# EAGLE schematic RASPILOT_BETA (EAGLE 7.2.0)

## Sheet 1 of 9
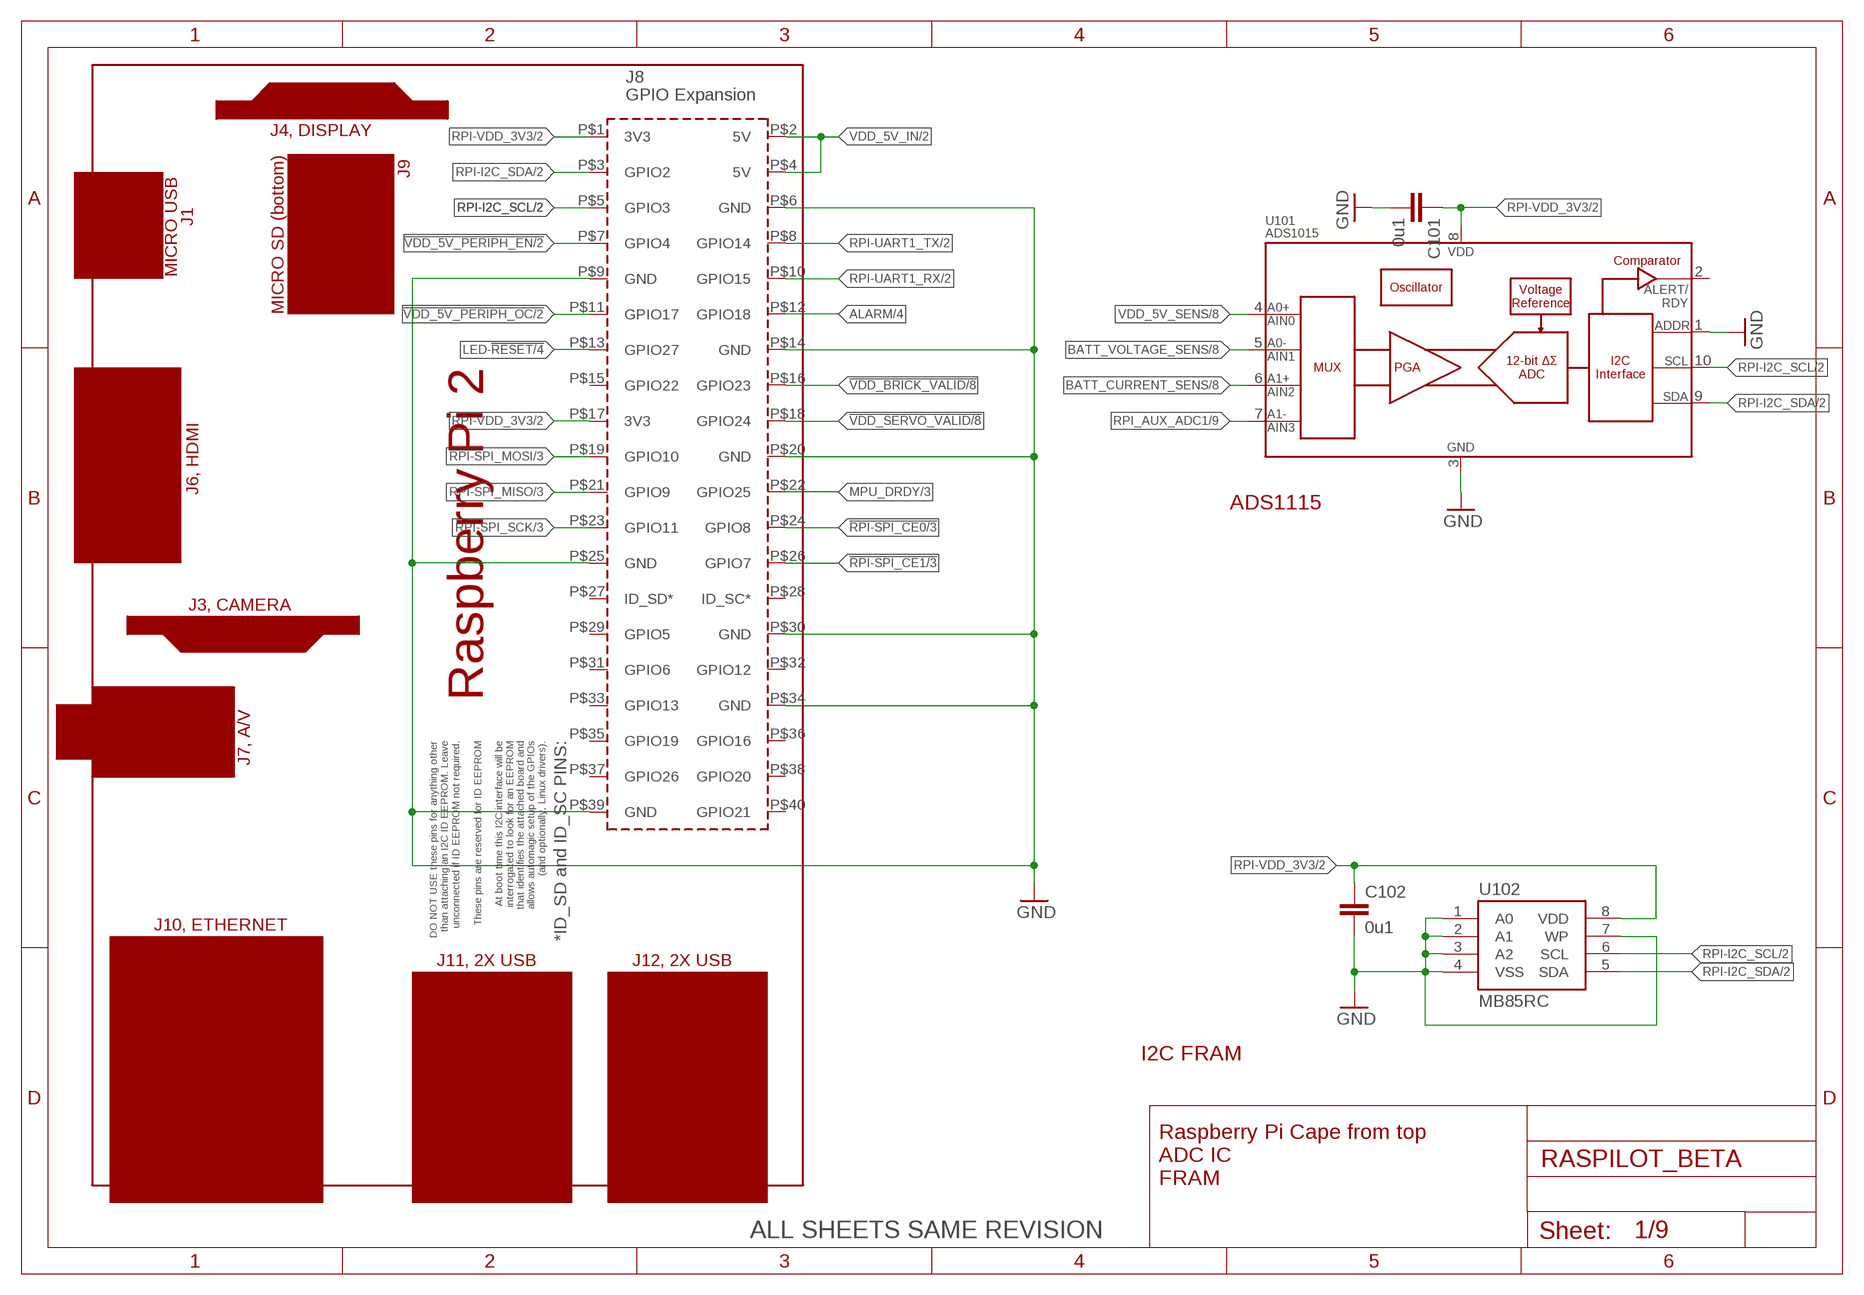
[diagram p0: schematic, sheet 1]

### Parts
C101  0u1  CAP0402  [0402-CAP]
C102  0u1  CAP0402  [0402-CAP]
J101  RPI2  [RPI2]
U101  ADS1015  [MSOP10]
U102  MB85RC  [SOP8]

### Nets
!RPI-SPI_CE0: J101.P$24(GPIO8) ; also sheet 3
!RPI-SPI_CE1: J101.P$26(GPIO7) ; also sheet 3
!VDD_5V_PERIPH_EN: J101.P$7(GPIO4) ; also sheet 2
!VDD_5V_PERIPH_OC: J101.P$11(GPIO17) ; also sheet 2
!VDD_BRICK_VALID: J101.P$16(GPIO23) ; also sheet 8,9
!VDD_SERVO_VALID: J101.P$18(GPIO24) ; also sheet 8,9
ALARM: J101.P$12(GPIO18) ; also sheet 4
BATT_CURRENT_SENS: U101.6(AIN2) ; also sheet 8
BATT_VOLTAGE_SENS: U101.5(AIN1) ; also sheet 8
GND [power]: C101.P$2 C102.P$2 J101.P$6(GND) J101.P$9(GND) J101.P$14(GND) J101.P$20(GND) J101.P$25(GND) J101.P$30(GND) J101.P$34(GND) J101.P$39(GND) U101.1(ADDR) U101.3(VSS) U102.1(A0) U102.2(A1) U102.3(A2) U102.4(VSS) U102.7(WP) ; also sheet 2,3,4,5,6,7,8,9
LED-!RESET: J101.P$13(GPIO27) ; also sheet 4
MPU_DRDY [power]: J101.P$22(GPIO25) ; also sheet 3
RPI-I2C_SCL: J101.P$5(GPIO3) U101.10(SCL) U102.6(SCL) ; also sheet 2,3,4,5
RPI-I2C_SDA: J101.P$3(GPIO2) U101.9(SDA) U102.5(SDA) ; also sheet 2,3,4,5
RPI-SPI_MISO: J101.P$21(GPIO9) ; also sheet 3
RPI-SPI_MOSI: J101.P$19(GPIO10) ; also sheet 3
RPI-SPI_SCK: J101.P$23(GPIO11) ; also sheet 3
RPI-UART1_RX: J101.P$10(GPIO15) ; also sheet 2
RPI-UART1_TX: J101.P$8(GPIO14) ; also sheet 2
RPI-VDD_3V3 [power]: C101.P$1 C102.P$1 J101.P$1(3V3) J101.P$17(3V3) U101.8(VDD) U102.8(VDD) ; also sheet 2,3,4,9
RPI_AUX_ADC1: U101.7(AIN3) ; also sheet 9
VDD_5V_IN [power]: J101.P$2(5V) J101.P$4(5V) ; also sheet 2,4,7,8,9
VDD_5V_SENS: U101.4(AIN0) ; also sheet 8
Unconnected: J101.P$15(GPIO22) J101.P$27(ID_SD*) J101.P$28(ID_SC*) J101.P$29(GPIO5) J101.P$31(GPIO6) J101.P$32(GPIO12) J101.P$33(GPIO13) J101.P$35(GPIO19) J101.P$36(GPIO16) J101.P$37(GPIO26) J101.P$38(GPIO20) J101.P$40(GPIO21) U101.2(ALERT/RDY)

### Notes on the sheet
- ADS1115
- I2C FRAM
- Raspberry Pi Cape from top
  ADC IC
  FRAM
- ALL SHEETS SAME REVISION

## Sheet 2 of 9
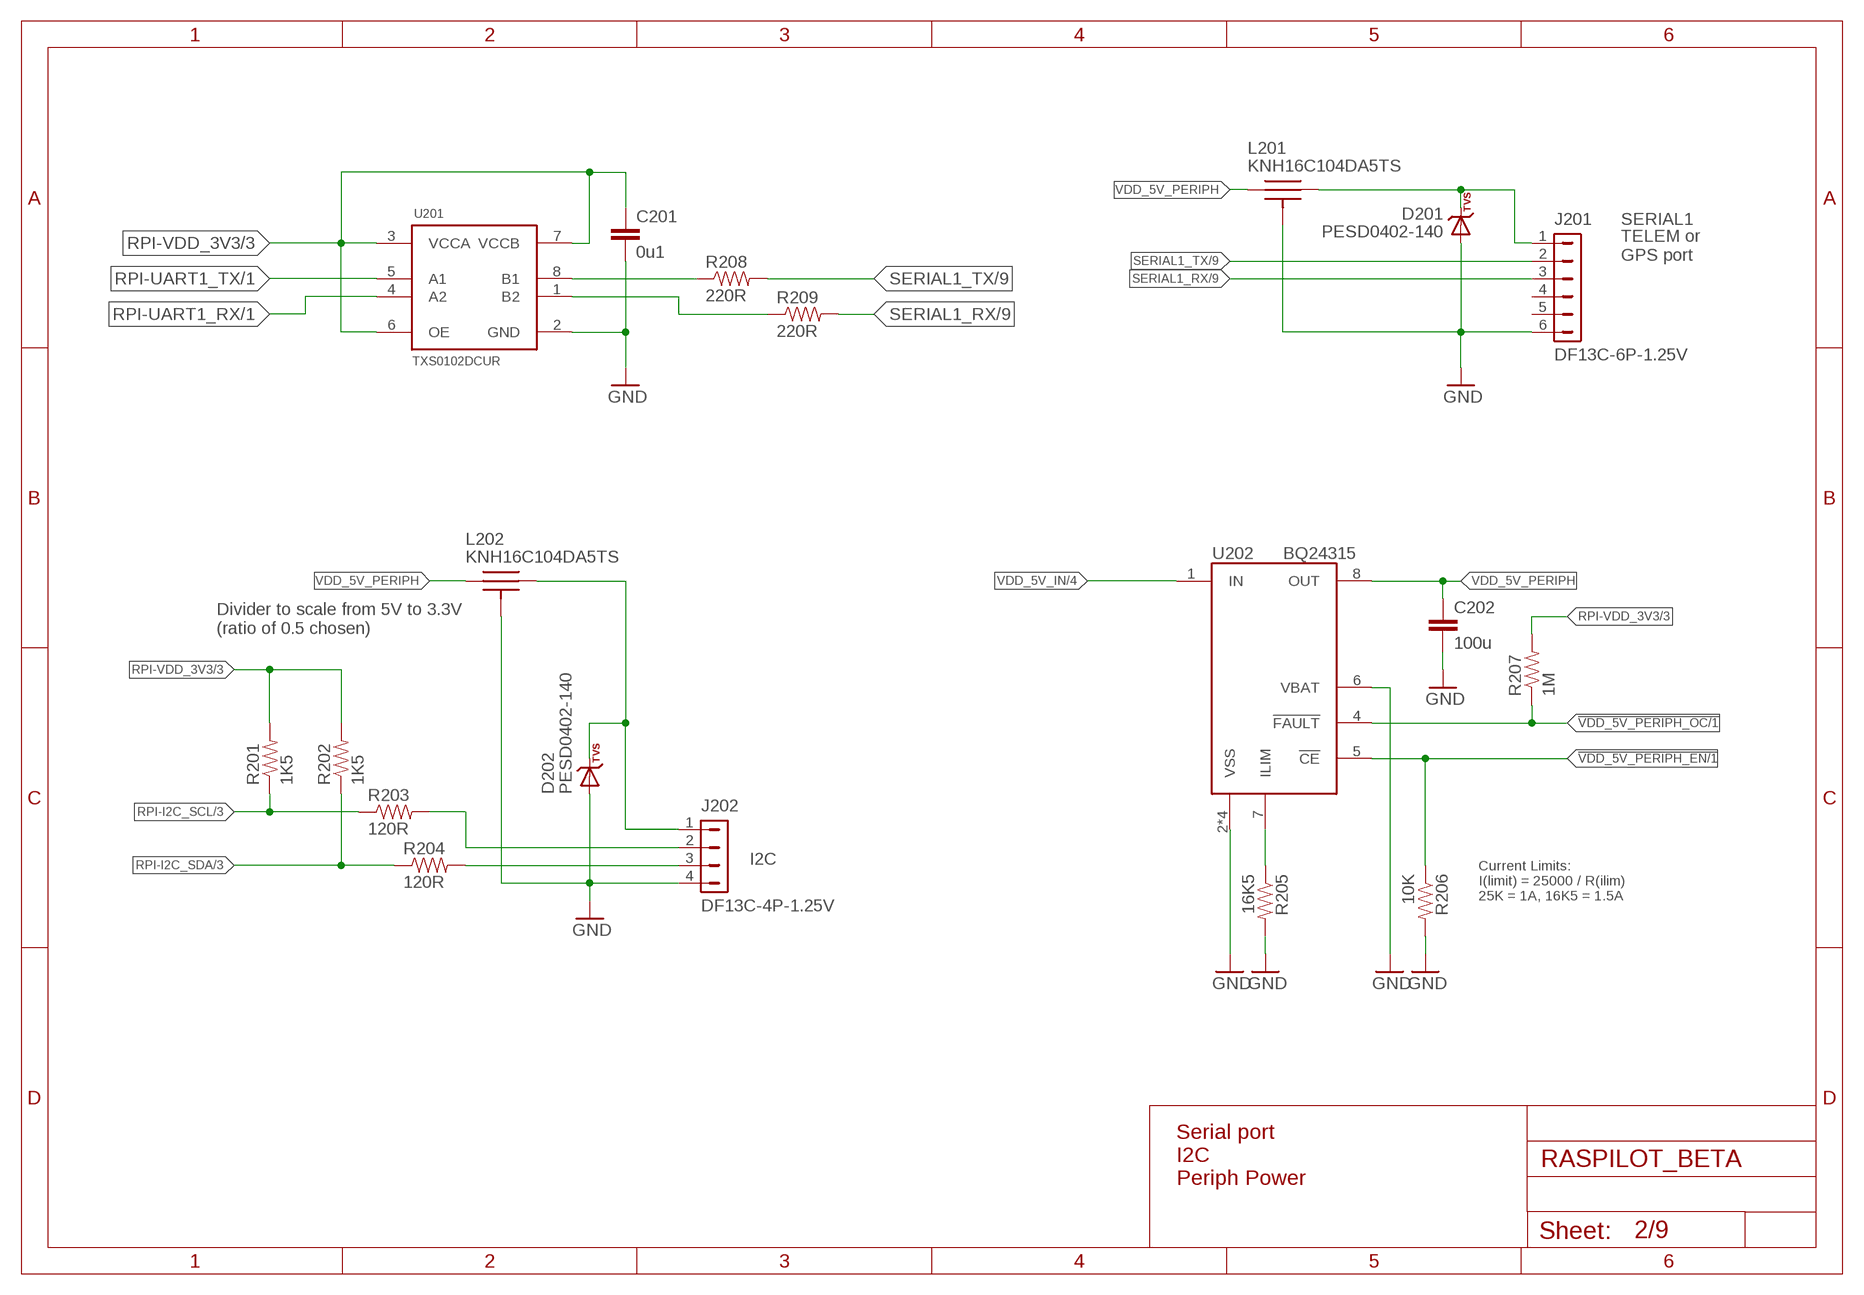
[diagram p1: schematic, sheet 2]

### Parts
C201  0u1  CAP0402  [0402-CAP]
C202  100u  CAP1206  [1206-CAP]
D201  PESD0402-140  DIODE-TVS  [0402-TVS]
D202  PESD0402-140  DIODE-TVS  [0402-TVS]
J201  DF13C-6P-1.25V  DF13-6P-1.25V  [DF13C-6P-1.25V]
J202  DF13C-4P-1.25V  DF13-4P-1.25V  [DF13C-4P-1.25V]
L201  KNH16C104DA5TS  [KYOCERA-KNH16-DA]
L202  KNH16C104DA5TS  [KYOCERA-KNH16-DA]
R201  1K5  RESISTOR0402-RES  [0402-RES]
R202  1K5  RESISTOR0402-RES  [0402-RES]
R203  120R  RESISTOR0402-RES  [0402-RES]
R204  120R  RESISTOR0402-RES  [0402-RES]
R205  16K5  RESISTOR0402-RES  [0402-RES]
R206  10K  RESISTOR0402-RES  [0402-RES]
R207  1M  RESISTOR0402-RES  [0402-RES]
R208  220R  RESISTOR0402-RES  [0402-RES]
R209  220R  RESISTOR0402-RES  [0402-RES]
U201  TXS0102DCUR  [TI-DCU]
U202  BQ24315  [QFN8-DSG]

### Nets
!VDD_5V_PERIPH_EN: R206.P$1 U202.5(!CE) ; also sheet 1
!VDD_5V_PERIPH_OC: R207.P$1 U202.4(!FAULT) ; also sheet 1
GND [power]: C201.P$2 C202.P$2 D201.A D202.A J201.6 J202.4 L201.P$3 L201.P$4 L201.P$5 L202.P$3 L202.P$4 L202.P$5 R205.P$2 R206.P$2 U201.2(GND) U202.2(VSS) U202.6(VBAT) U202.GND(VSS) U202.P$2(VSS) U202.P$3(VSS) ; also sheet 1,3,4,5,6,7,8,9
N$14: J202.2 R203.P$2
N$15: J202.3 R204.P$2
N$16 [power]: D202.C J202.1 L202.P$2
N$24: R208.P$1 U201.8(B1)
N$25: R209.P$1 U201.1(B2)
N$27: R205.P$1 U202.7(ILIM)
N$100 [power]: D201.C J201.1 L201.P$2
RPI-I2C_SCL: R201.P$1 R203.P$1 ; also sheet 1,3,4,5
RPI-I2C_SDA: R202.P$1 R204.P$1 ; also sheet 1,3,4,5
RPI-UART1_RX: U201.4(A2) ; also sheet 1
RPI-UART1_TX: U201.5(A1) ; also sheet 1
RPI-VDD_3V3 [power]: C201.P$1 R201.P$2 R202.P$2 R207.P$2 U201.3(VCCA) U201.6(OE) U201.7(VCCB) ; also sheet 1,3,4,9
SERIAL1_RX: J201.3 R209.P$2 ; also sheet 9
SERIAL1_TX: J201.2 R208.P$2 ; also sheet 9
VDD_5V_IN [power]: U202.1(IN) ; also sheet 1,4,7,8,9
VDD_5V_PERIPH [power]: C202.P$1 L201.P$1 L202.P$1 U202.8(OUT)
Unconnected: J201.4 J201.5

### Notes on the sheet
- SERIAL1
- TELEM or 
  GPS port
- Divider to scale from 5V to 3.3V
  (ratio of 0.5 chosen)
- I2C
- Current Limits:
  I(limit) = 25000 / R(ilim)
  25K = 1A, 16K5 = 1.5A
- Serial port
  I2C
  Periph Power

## Sheet 3 of 9
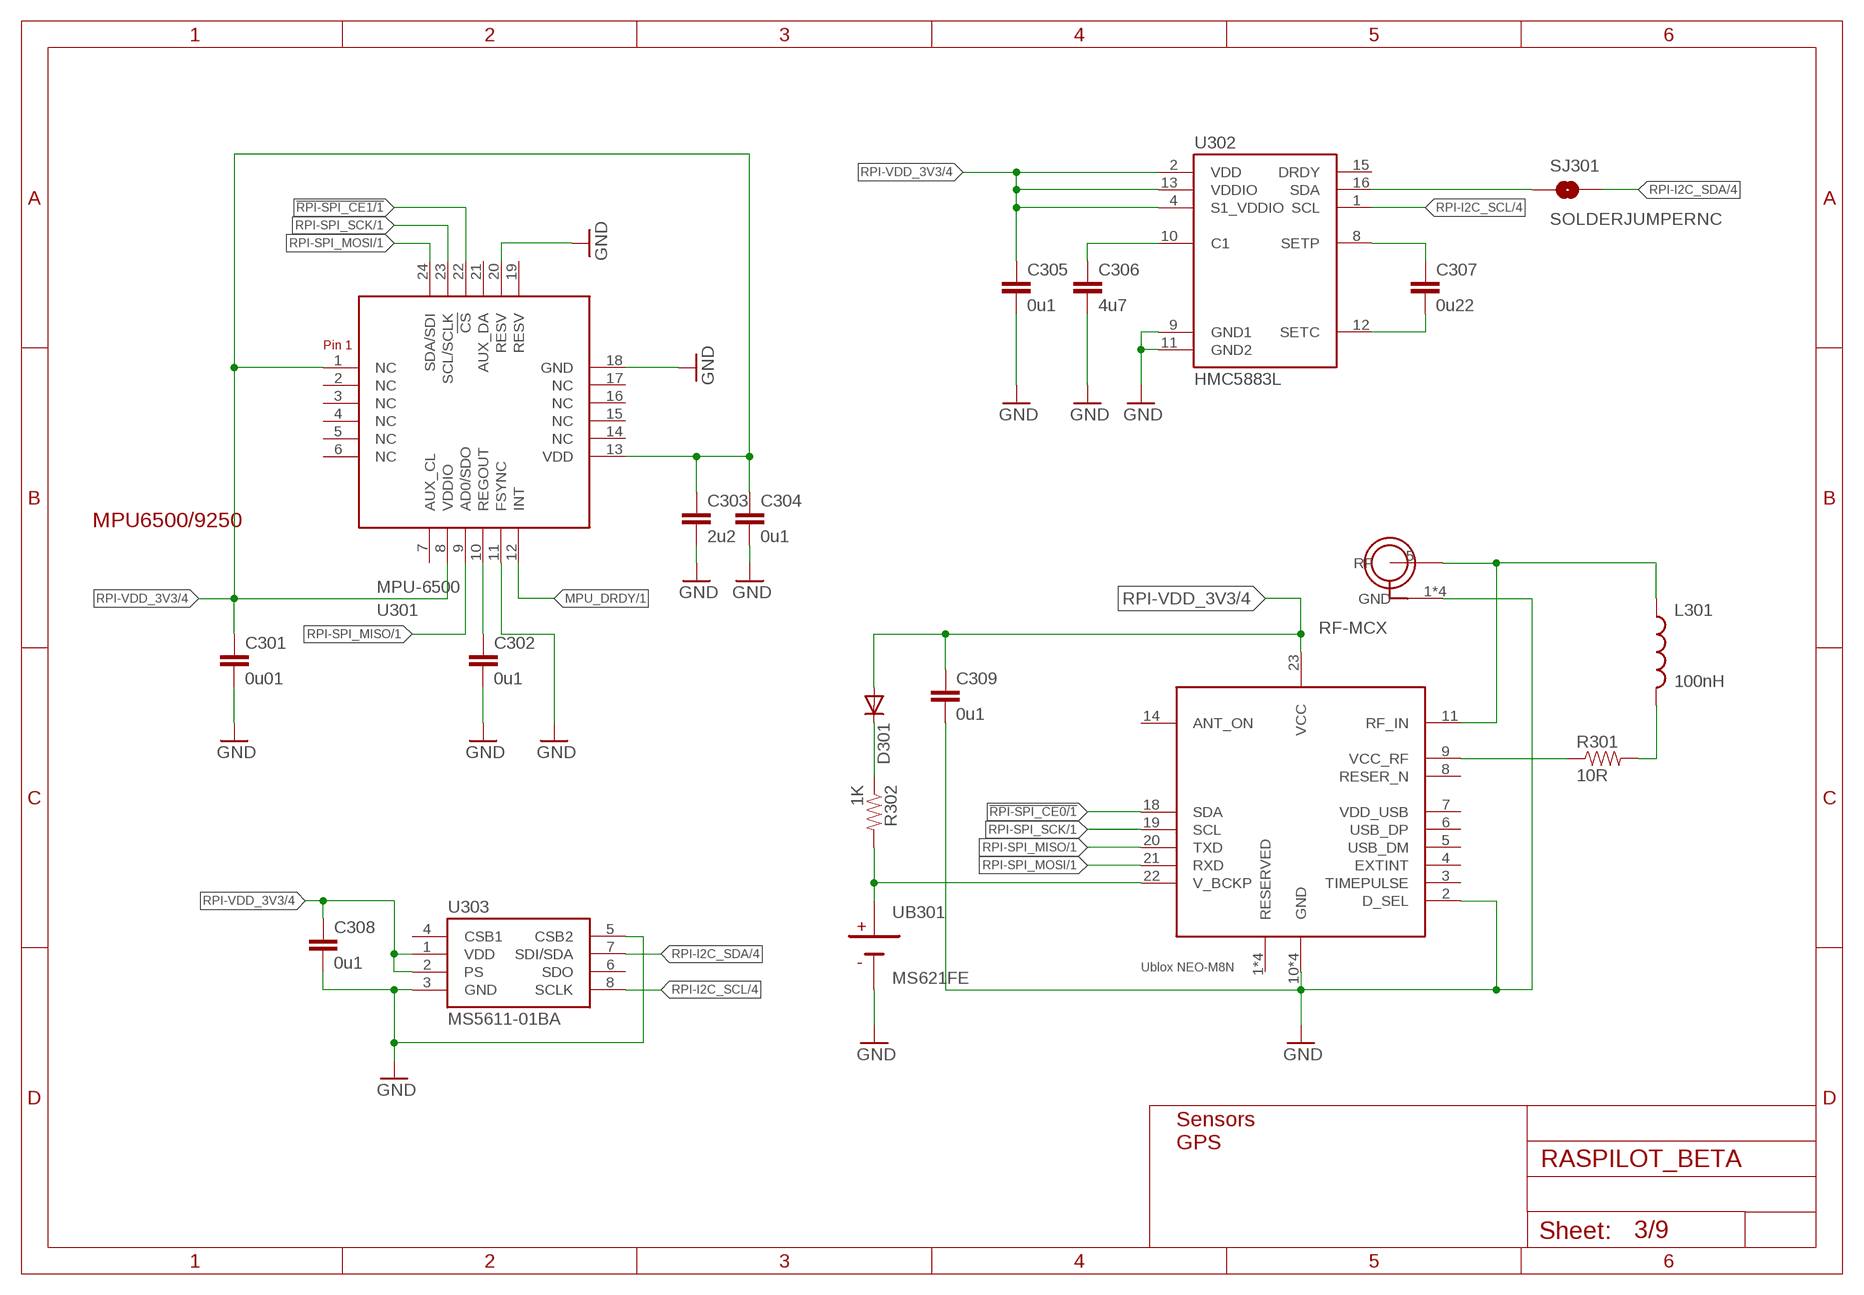
[diagram p2: schematic, sheet 3]

### Parts
C301  0u01  CAP0402  [0402-CAP]
C302  0u1  CAP0402  [0402-CAP]
C303  2u2  CAP0603  [0603-CAP]
C304  0u1  CAP0402  [0402-CAP]
C305  0u1  CAP0402  [0402-CAP]
C306  4u7  CAP0603  [0603-CAP]
C307  0u22  CAP0402  [0402-CAP]
C308  0u1  CAP0402  [0402-CAP]
C309  0u1  CAP0402  [0402-CAP]
D301  DIODE-0603  [0603-DIO]
J301  RF-MCX  [RF-MCX-H]
L301  100nH  INDUCTOR0603  [0603-IND]
R301  10R  RESISTOR0603-RES  [0603-RES]
R302  1K  RESISTOR0402-RES  [0402-RES]
SJ301  SOLDERJUMPERNC  [SJ_2S]
U301  MPU-6500  [MPU-6500]
U302  HMC5883L  [HMC5883L-MAN]
U303  MS5611-01BA  [MS5611-01BA]
U304  NEO-M8N  [NEO-M8N]
UB301  MS621FE  [MS621FE]

### Nets
!RPI-SPI_CE0: U304.18(SDA) ; also sheet 1
!RPI-SPI_CE1: U301.22(!CS) ; also sheet 1
GND [power]: C301.P$2 C302.P$2 C303.P$2 C304.P$2 C305.P$2 C306.P$2 C308.P$2 C309.P$2 J301.1(GND) J301.2(GND) J301.3(GND) J301.4(GND) U301.11(FSYNC) U301.18(GND) U301.20(RESV) U302.9(GND1) U302.11(GND2) U303.3(GND) U303.5(CSB2) U304.2(D_SEL) U304.10(GND) U304.12(GND) U304.13(GND) U304.24(GND) UB301.2(NEG) ; also sheet 1,2,4,5,6,7,8,9
MPU_DRDY [power]: U301.12(INT) ; also sheet 1
N$1: C302.P$1 U301.10(REGOUT)
N$2: C306.P$1 U302.10(C1)
N$10: C307.P$1 U302.8(SETP)
N$19: C307.P$2 U302.12(SETC)
N$23: SJ301.1 U302.16(SDA)
N$32: J301.5(RF) L301.P$1 U304.11(RF_IN)
N$33 [power]: R302.P$2 U304.22(V_BCKP) UB301.1(POS)
N$34: R301.1 U304.9(VCC_RF)
N$35: L301.P$2 R301.2
N$36: D301.C R302.P$1
RPI-I2C_SCL: U302.1(SCL) U303.8(SCLK) ; also sheet 1,2,4,5
RPI-I2C_SDA: SJ301.2 U303.7(SDI/SDA) ; also sheet 1,2,4,5
RPI-SPI_MISO: U301.9(AD0/SDO) U304.20(TXD) ; also sheet 1
RPI-SPI_MOSI: U301.24(SDA/SDI) U304.21(RXD) ; also sheet 1
RPI-SPI_SCK: U301.23(SCL/SCLK) U304.19(SCL) ; also sheet 1
RPI-VDD_3V3 [power]: C301.P$1 C303.P$1 C304.P$1 C305.P$1 C308.P$1 C309.P$1 D301.A U301.1(NC) U301.8(VDDIO) U301.13(VDD) U302.2(VDD) U302.4(S1_VDDIO) U302.13(VDDIO) U303.1(VDD) U303.2(PS) U304.23(VCC) ; also sheet 1,2,4,9
Unconnected: U301.2(NC) U301.3(NC) U301.4(NC) U301.5(NC) U301.6(NC) U301.7(AUX_CL) U301.14(NC) U301.15(NC) U301.16(NC) U301.17(NC) U301.19(RESV) U301.21(AUX_DA) U302.3(NC_P3) U302.5(NC_P5) U302.6(NC_P6) U302.7(NC_P7) U302.14(NC_P14) U302.15(DRDY) U303.4(CSB1) U303.6(SDO) U304.1(RESERVED) U304.3(TIMEPULSE) U304.4(EXTINT) U304.5(USB_DM) U304.6(USB_DP) U304.7(VDD_USB) U304.8(RESER_N) U304.14(ANT_ON) U304.15(RESERVED) U304.16(RESERVED) U304.17(RESERVED)

### Notes on the sheet
- MPU6500/9250
- Sensors
  GPS

## Sheet 4 of 9
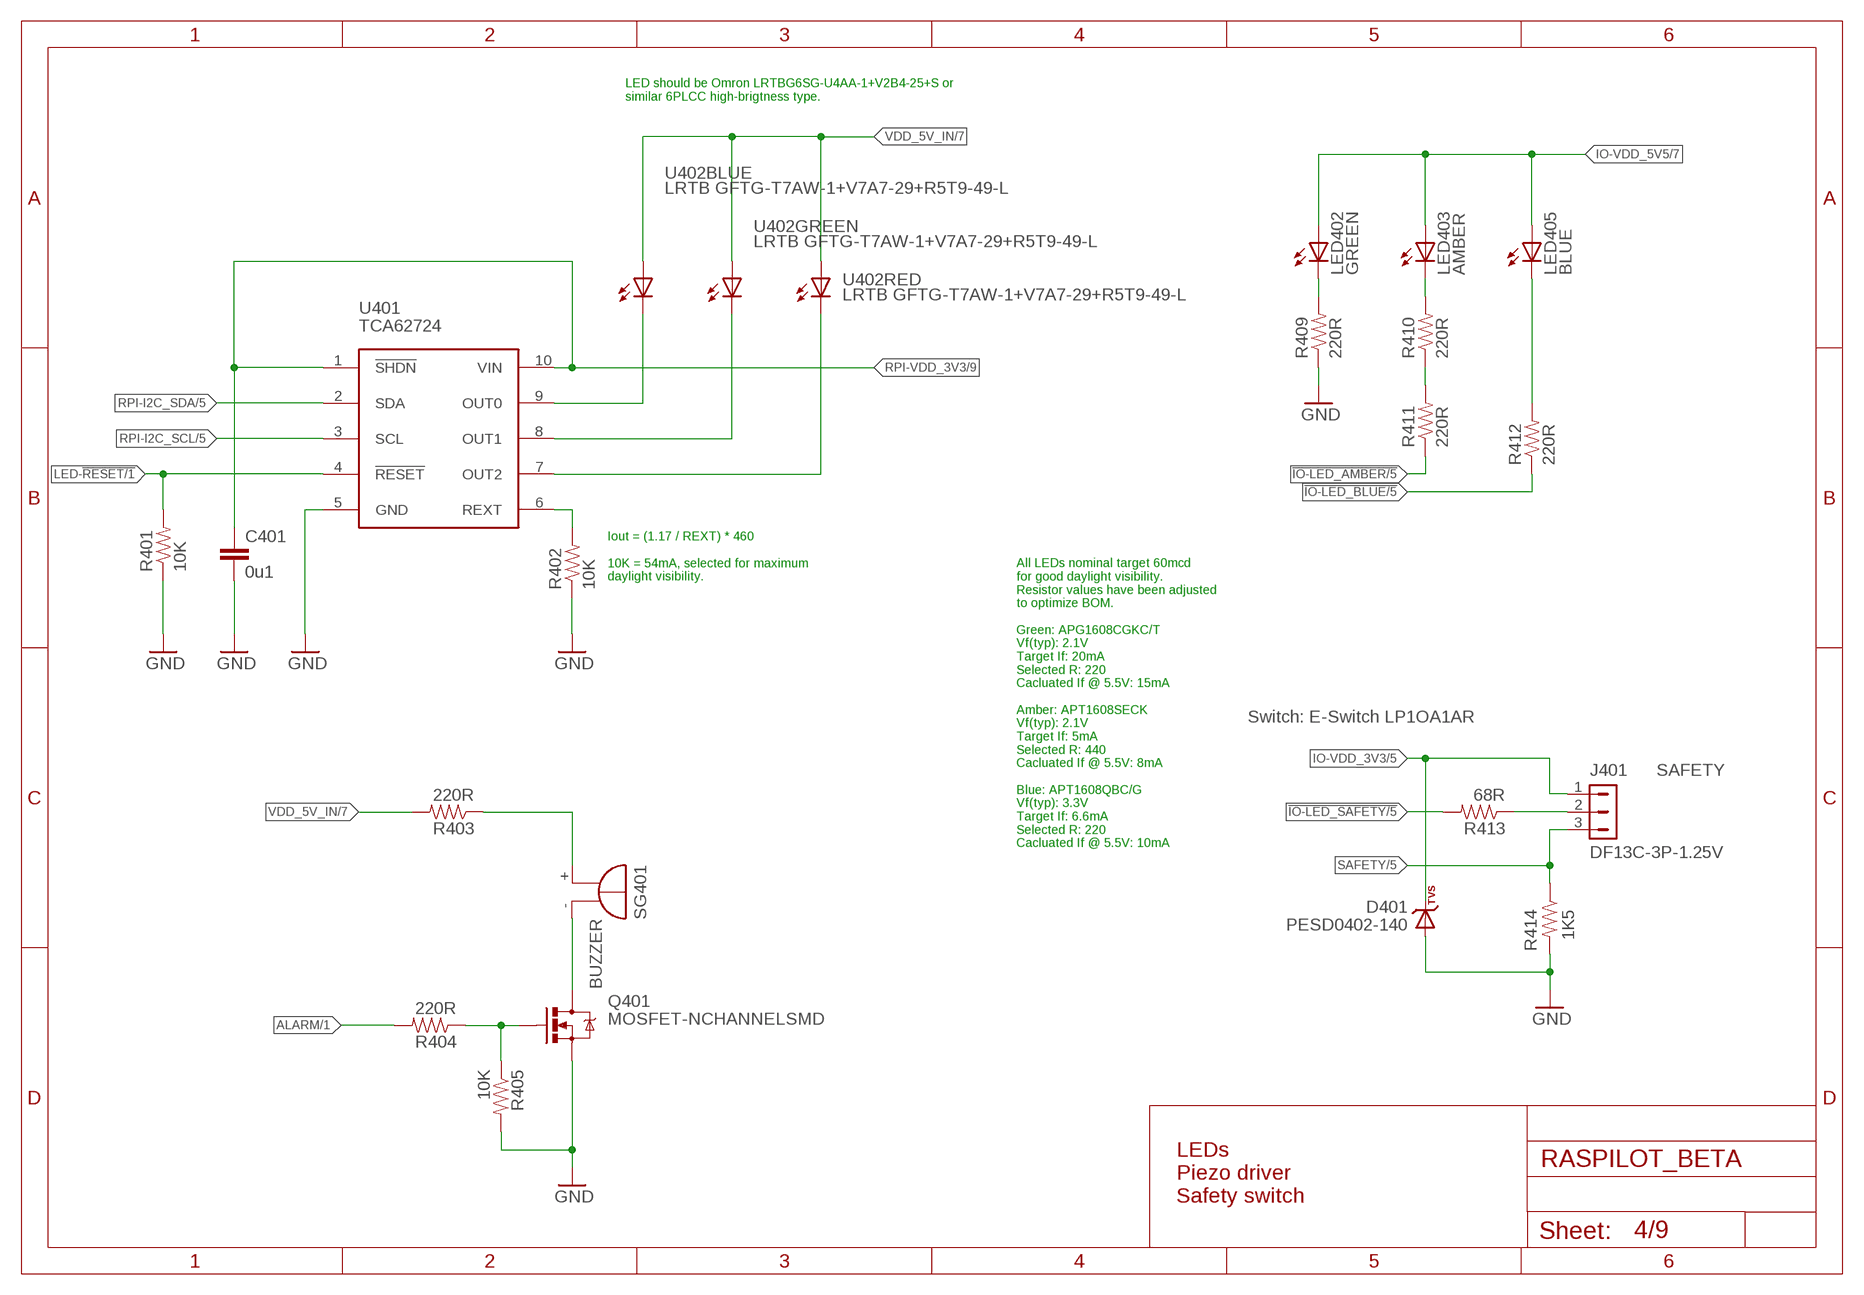
[diagram p3: schematic, sheet 4]

### Parts
C401  0u1  CAP0402  [0402-CAP]
D401  PESD0402-140  DIODE-TVS  [0402-TVS]
J401  DF13C-3P-1.25V  DF13-3P-1.25V  [DF13C-3P-1.25V]
LED402  GREEN  LED0603  [0603-LED]
LED403  AMBER  LED0603  [0603-LED]
LED405  BLUE  LED0603  [0603-LED]
Q401  MOSFET-NCHANNELSMD  [SOT23-3]
R401  10K  RESISTOR0402-RES  [0402-RES]
R402  10K  RESISTOR0402-RES  [0402-RES]
R403  220R  RESISTOR0402-RES  [0402-RES]
R404  220R  RESISTOR0402-RES  [0402-RES]
R405  10K  RESISTOR0402-RES  [0402-RES]
R409  220R  RESISTOR0402-RES  [0402-RES]
R410  220R  RESISTOR0402-RES  [0402-RES]
R411  220R  RESISTOR0402-RES  [0402-RES]
R412  220R  RESISTOR0402-RES  [0402-RES]
R413  68R  RESISTOR0402-RES  [0402-RES]
R414  1K5  RESISTOR0402-RES  [0402-RES]
SG401  BUZZER  [F/TMB]
U401  TCA62724FMG  [SON10]
U402  LRTB GFTG-T7AW-1+V7A7-29+R5T9-49-L  RGB-LED6-PLCC  [6-PLCC]

### Nets
!IO-LED_AMBER: R411.P$1 ; also sheet 5
!IO-LED_BLUE: R412.P$1 ; also sheet 5
!IO-LED_SAFETY: R413.P$2 ; also sheet 5
ALARM: R404.P$2 ; also sheet 1
GND [power]: C401.P$2 D401.A Q401.2(S) R401.P$1 R402.P$1 R405.P$2 R409.P$1 R414.P$2 U401.5(GND) ; also sheet 1,2,3,5,6,7,8,9
IO-VDD_3V3 [power]: D401.C J401.1 ; also sheet 5,6,7
IO-VDD_5V5 [power]: LED402.A LED403.A LED405.A ; also sheet 7
LED-!RESET: R401.P$2 U401.4(!RESET) ; also sheet 1
N$5: Q401.1(G) R404.P$1 R405.P$1
N$9: LED405.C R412.P$2
N$17: R403.P$1 SG401.+
N$21: Q401.3(D) SG401.-
N$29: LED402.C R409.P$2
N$39: R410.P$1 R411.P$2
N$40: LED403.C R410.P$2
N$57: J401.2 R413.P$1
N$95: R402.P$2 U401.6(REXT)
RGB_LED_3: U401.9(OUT0) U402.C1(BLUE:C)
RGB_LED_4: U401.8(OUT1) U402.C2(GREEN:C)
RGB_LED_14: U401.7(OUT2) U402.C3(RED:C)
RPI-I2C_SCL: U401.3(SCL) ; also sheet 1,2,3,5
RPI-I2C_SDA: U401.2(SDA) ; also sheet 1,2,3,5
RPI-VDD_3V3 [power]: C401.P$1 U401.1(!SHDN) U401.10(VIN) ; also sheet 1,2,3,9
SAFETY: J401.3 R414.P$1 ; also sheet 5
VDD_5V_IN [power]: R403.P$2 U402.A1(BLUE:A) U402.A2(GREEN:A) U402.A3(RED:A) ; also sheet 1,2,7,8,9

### Notes on the sheet
- LED should be Omron LRTBG6SG-U4AA-1+V2B4-25+S or 
  similar 6PLCC high-brigtness type.
- Iout = (1.17 / REXT) * 460
  
  10K = 54mA, selected for maximum
  daylight visibility.
- Switch: E-Switch LP1OA1AR
- SAFETY
- All LEDs nominal target 60mcd
  for good daylight visibility.
  Resistor values have been adjusted
  to optimize BOM.
  
  Green: APG1608CGKC/T
  Vf(typ): 2.1V
  Target If: 20mA
  Selected R: 220
  Cacluated If @ 5.5V: 15mA
  
  Amber: APT1608SECK
  Vf(typ): 2.1V
  Target If: 5mA
  Selected R: 440
  Cacluated If @ 5.5V: 8mA
  
  Blue: APT1608QBC/G
  Vf(typ): 3.3V
  Target If: 6.6mA
  Selected R: 220
  Cacluated If @ 5.5V: 10mA
- LEDs
  Piezo driver
  Safety switch

## Sheet 5 of 9
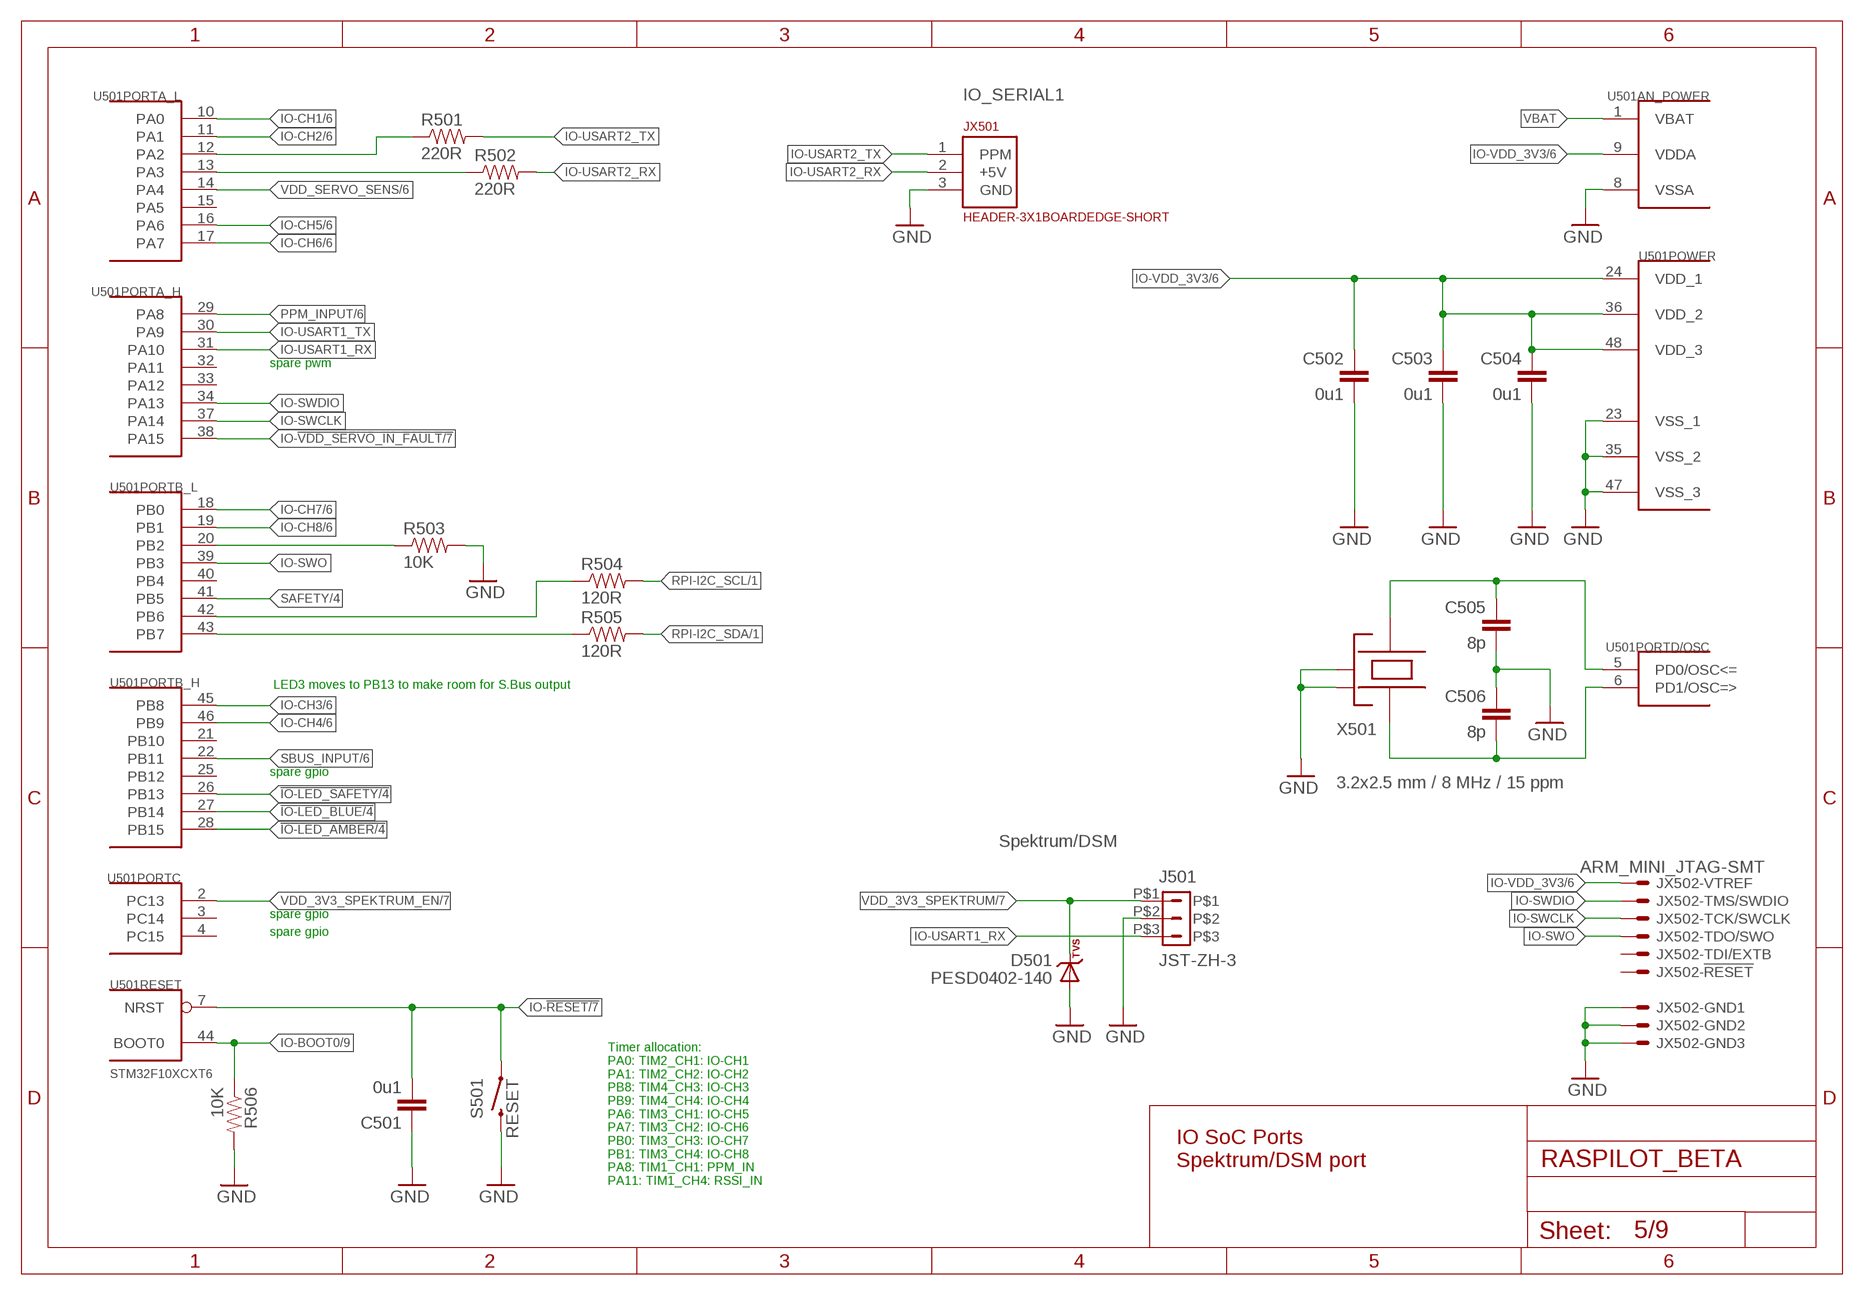
[diagram p4: schematic, sheet 5]

### Parts
C501  0u1  CAP0402  [0402-CAP]
C502  0u1  CAP0402  [0402-CAP]
C503  0u1  CAP0402  [0402-CAP]
C504  0u1  CAP0402  [0402-CAP]
C505  8p  CAP0402  [0402-CAP]
C506  8p  CAP0402  [0402-CAP]
D501  PESD0402-140  DIODE-TVS  [0402-TVS]
J501  JST-ZH-3  [JST-ZH-SMT-VERTICAL]
JX501  HEADER-3X1BOARDEDGE-SHORT  [HEADER_3X01_SMD_H_BOARD_EDGE_SHORT]
JX502  ARM_MINI_JTAG-SMT  [FTSH-105-01-XXX-DV-K]
R501  220R  RESISTOR0402-RES  [0402-RES]
R502  220R  RESISTOR0402-RES  [0402-RES]
R503  10K  RESISTOR0402-RES  [0402-RES]
R504  120R  RESISTOR0402-RES  [0402-RES]
R505  120R  RESISTOR0402-RES  [0402-RES]
R506  10K  RESISTOR0402-RES  [0402-RES]
S501  RESET  SWITCH-MOMENTARY-2  [EVQP7J01K]
U501  STM32F10XCXT6  [TQFP48]
X501  3.2x2.5 mm / 8 MHz / 15 ppm  OSCILLATOR-3.2X2.5  [OSCILLATOR-3.2X2.5]

### Nets
!IO-LED_AMBER: U501.28(PORTB_H:PB15) ; also sheet 4
!IO-LED_BLUE: U501.27(PORTB_H:PB14) ; also sheet 4
!IO-LED_SAFETY: U501.26(PORTB_H:PB13) ; also sheet 4
GND [power]: C501.P$1 C502.P$2 C503.P$2 C504.P$2 C505.P$2 C506.P$1 D501.A J501.P$2 JX501.3(GND) JX502.3 JX502.5 JX502.9 R503.P$2 R506.P$2 S501.B3 U501.8(AN_POWER:VSSA) U501.23(POWER:VSS_1) U501.35(POWER:VSS_2) U501.47(POWER:VSS_3) X501.2(NC_2) X501.4(NC_4) ; also sheet 1,2,3,4,6,7,8,9
IO-!RESET: C501.P$2 S501.A1 U501.7(RESET:NRST) ; also sheet 7
IO-!VDD_SERVO_IN_FAULT: U501.38(PORTA_H:PA15) ; also sheet 7
IO-BOOT0: R506.P$1 U501.44(RESET:BOOT0) ; also sheet 9
IO-BOOT1: R503.P$1 U501.20(PORTB_L:PB2)
IO-CH1: U501.10(PORTA_L:PA0) ; also sheet 6
IO-CH2: U501.11(PORTA_L:PA1) ; also sheet 6
IO-CH3: U501.45(PORTB_H:PB8) ; also sheet 6
IO-CH4: U501.46(PORTB_H:PB9) ; also sheet 6
IO-CH5: U501.16(PORTA_L:PA6) ; also sheet 6
IO-CH6: U501.17(PORTA_L:PA7) ; also sheet 6
IO-CH7: U501.18(PORTB_L:PB0) ; also sheet 6
IO-CH8: U501.19(PORTB_L:PB1) ; also sheet 6
IO-SWCLK: JX502.4 U501.37(PORTA_H:PA14)
IO-SWDIO: JX502.2 U501.34(PORTA_H:PA13)
IO-SWO: JX502.6 U501.39(PORTB_L:PB3)
IO-USART1_RX: J501.P$3 U501.31(PORTA_H:PA10)
IO-USART1_TX: U501.30(PORTA_H:PA9)
IO-USART2_RX: JX501.2(+5V) R502.P$2
IO-USART2_TX: JX501.1(PPM) R501.P$2
IO-VDD_3V3 [power]: C502.P$1 C503.P$1 C504.P$1 JX502.1 U501.9(AN_POWER:VDDA) U501.24(POWER:VDD_1) U501.36(POWER:VDD_2) U501.48(POWER:VDD_3) ; also sheet 4,6,7
N$6: R505.P$1 U501.43(PORTB_L:PB7)
N$8: R504.P$1 U501.42(PORTB_L:PB6)
N$18: C506.P$2 U501.6(PORTD/OSC:PD1/OSC=>) X501.1
N$22: C505.P$1 U501.5(PORTD/OSC:PD0/OSC<=) X501.3
N$28: R501.P$1 U501.12(PORTA_L:PA2)
N$30: R502.P$1 U501.13(PORTA_L:PA3)
PPM_INPUT: U501.29(PORTA_H:PA8) ; also sheet 6
RPI-I2C_SCL: R504.P$2 ; also sheet 1,2,3,4
RPI-I2C_SDA: R505.P$2 ; also sheet 1,2,3,4
SAFETY: U501.41(PORTB_L:PB5) ; also sheet 4
SBUS_INPUT: U501.22(PORTB_H:PB11) ; also sheet 6
VBAT: U501.1(AN_POWER:VBAT)
VDD_3V3_SPEKTRUM [power]: D501.C J501.P$1 ; also sheet 7
VDD_3V3_SPEKTRUM_EN: U501.2(PORTC:PC13) ; also sheet 7
VDD_SERVO_SENS: U501.14(PORTA_L:PA4) ; also sheet 6
Unconnected: JX502.8 JX502.10 U501.3(PORTC:PC14) U501.4(PORTC:PC15) U501.15(PORTA_L:PA5) U501.21(PORTB_H:PB10) U501.25(PORTB_H:PB12) U501.32(PORTA_H:PA11) U501.33(PORTA_H:PA12) U501.40(PORTB_L:PB4)

### Notes on the sheet
- IO_SERIAL1
- spare pwm
- LED3 moves to PB13 to make room for S.Bus output
- spare gpio
- Spektrum/DSM
- spare gpio
- spare gpio
- IO SoC Ports
  Spektrum/DSM port
- Timer allocation:
  PA0: TIM2_CH1: IO-CH1
  PA1: TIM2_CH2: IO-CH2
  PB8: TIM4_CH3: IO-CH3
  PB9: TIM4_CH4: IO-CH4
  PA6: TIM3_CH1: IO-CH5
  PA7: TIM3_CH2: IO-CH6
  PB0: TIM3_CH3: IO-CH7
  PB1: TIM3_CH4: IO-CH8
  PA8: TIM1_CH1: PPM_IN
  PA11: TIM1_CH4: RSSI_IN

## Sheet 6 of 9
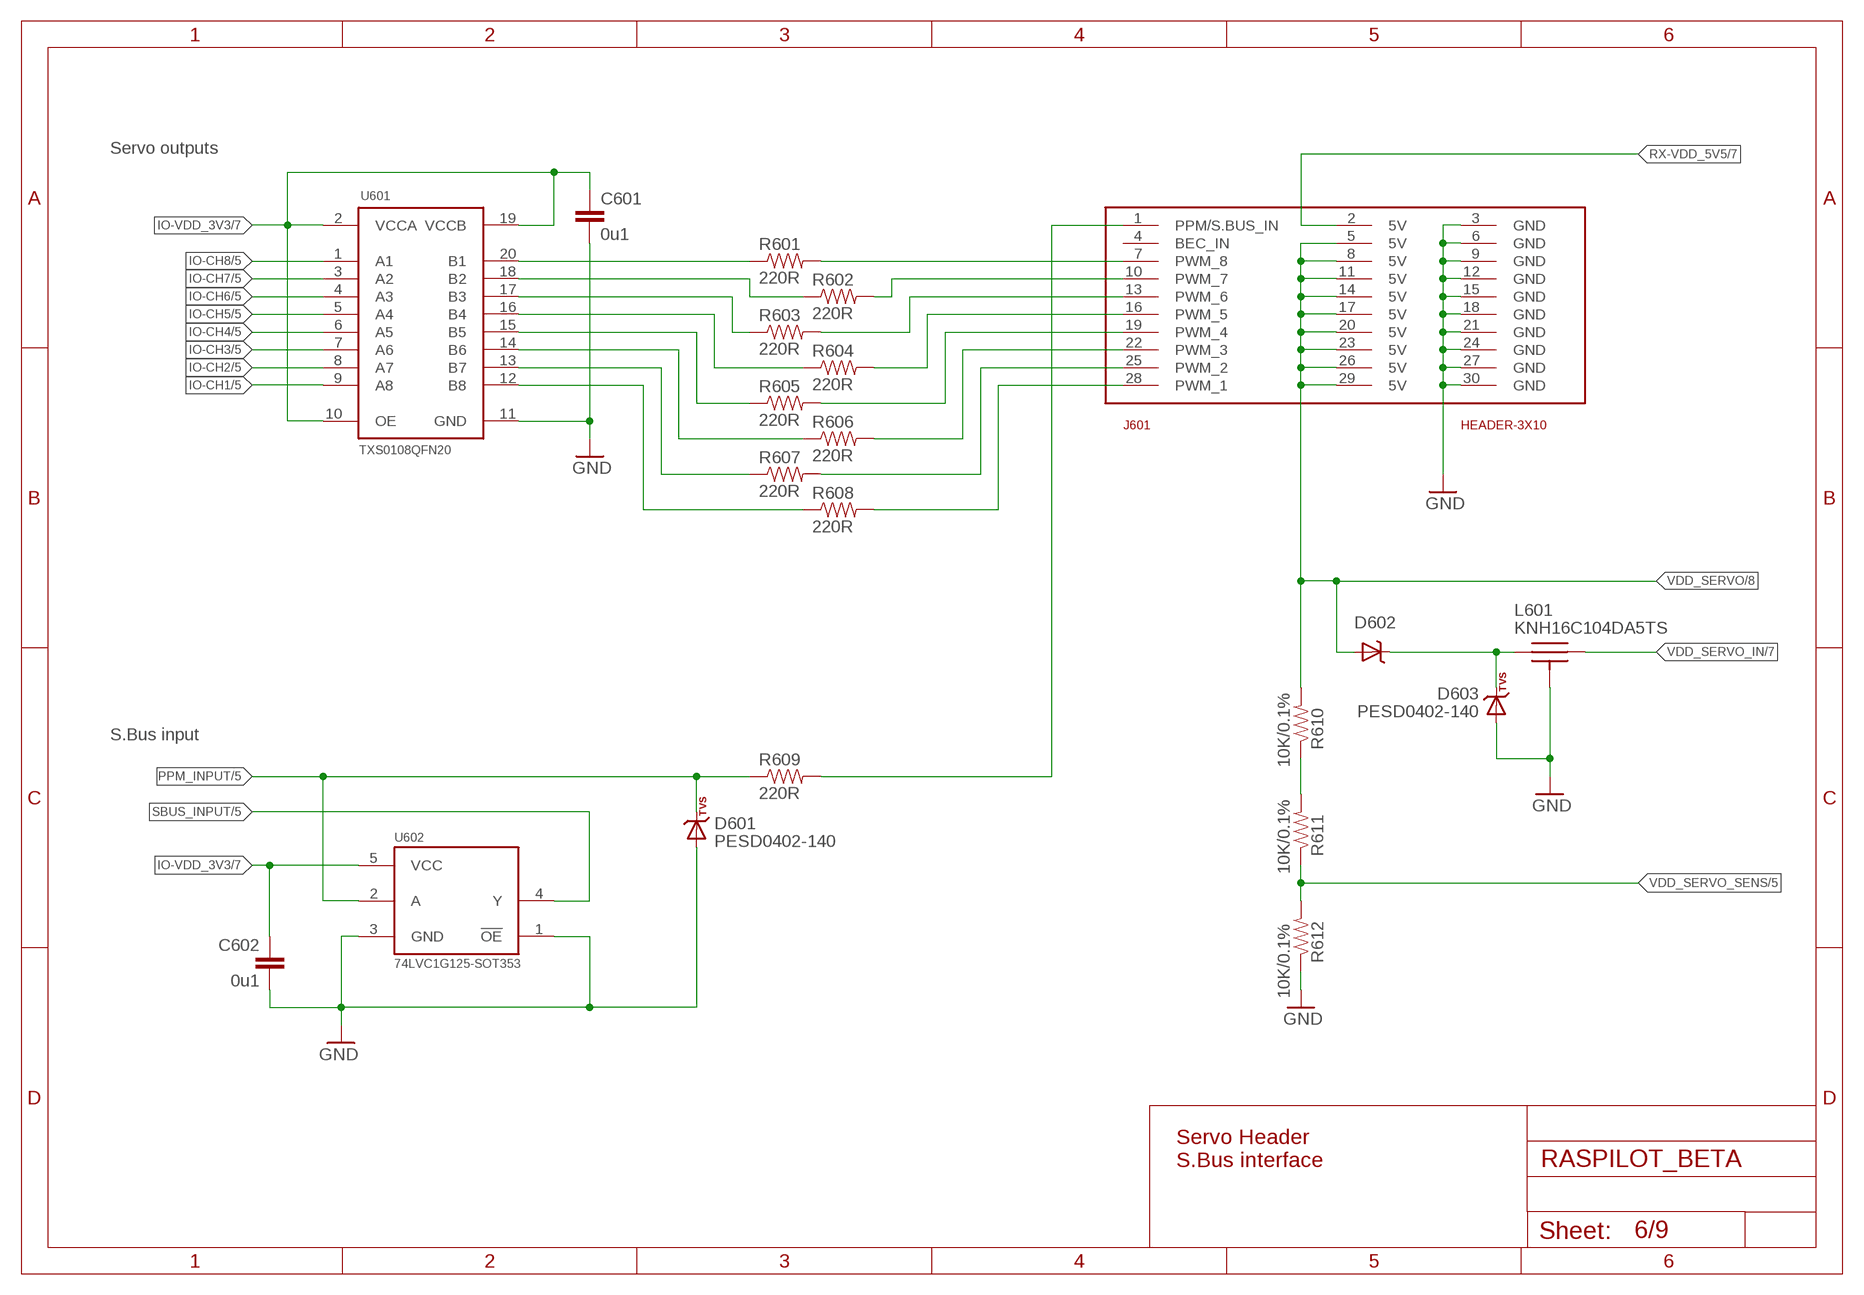
[diagram p5: schematic, sheet 6]

### Parts
C601  0u1  CAP0402  [0402-CAP]
C602  0u1  CAP0402  [0402-CAP]
D601  PESD0402-140  DIODE-TVS  [0402-TVS]
D602  MSS1P4-M3  DIODE-SCHOTTKY_MSMP  [MICROSMP]
D603  PESD0402-140  DIODE-TVS  [0402-TVS]
J601  HEADER-3X10  [3X10RA]
L601  KNH16C104DA5TS  [KYOCERA-KNH16-DA]
R601  220R  RESISTOR0402-RES  [0402-RES]
R602  220R  RESISTOR0402-RES  [0402-RES]
R603  220R  RESISTOR0402-RES  [0402-RES]
R604  220R  RESISTOR0402-RES  [0402-RES]
R605  220R  RESISTOR0402-RES  [0402-RES]
R606  220R  RESISTOR0402-RES  [0402-RES]
R607  220R  RESISTOR0402-RES  [0402-RES]
R608  220R  RESISTOR0402-RES  [0402-RES]
R609  220R  RESISTOR0402-RES  [0402-RES]
R610  10K/0.1%  RESISTOR0402-RES  [0402-RES]
R611  10K/0.1%  RESISTOR0402-RES  [0402-RES]
R612  10K/0.1%  RESISTOR0402-RES  [0402-RES]
U601  TXS0108QFN20  [QFN20-RGY]
U602  74LVC1G125-SOT353  [SOT353]

### Nets
GND [power]: C601.P$2 C602.P$2 D601.A D603.A J601.3(GND) J601.6(GND) J601.9(GND) J601.12(GND) J601.15(GND) J601.18(GND) J601.21(GND) J601.24(GND) J601.27(GND) J601.30(GND) L601.P$3 L601.P$4 L601.P$5 R612.P$1 U601.11(GND) U602.1(!OE) U602.3(GND) ; also sheet 1,2,3,4,5,7,8,9
IO-CH1: U601.9(A8) ; also sheet 5
IO-CH2: U601.8(A7) ; also sheet 5
IO-CH3: U601.7(A6) ; also sheet 5
IO-CH4: U601.6(A5) ; also sheet 5
IO-CH5: U601.5(A4) ; also sheet 5
IO-CH6: U601.4(A3) ; also sheet 5
IO-CH7: U601.3(A2) ; also sheet 5
IO-CH8: U601.1(A1) ; also sheet 5
IO-VDD_3V3 [power]: C601.P$1 C602.P$1 U601.2(VCCA) U601.10(OE) U601.19(VCCB) U602.5(VCC) ; also sheet 4,5,7
N$3: R610.P$1 R611.P$2
N$31: J601.7(PWM_8) R601.P$2
N$43: R601.P$1 U601.20(B1)
N$44: R602.P$1 U601.18(B2)
N$45: R603.P$1 U601.17(B3)
N$49: R604.P$1 U601.16(B4)
N$53: R605.P$1 U601.15(B5)
N$58: R606.P$1 U601.14(B6)
N$59: R607.P$1 U601.13(B7)
N$60: R608.P$1 U601.12(B8)
N$63: J601.10(PWM_7) R602.P$2
N$66: J601.28(PWM_1) R608.P$2
N$68: J601.25(PWM_2) R607.P$2
N$71: J601.22(PWM_3) R606.P$2
N$72: J601.19(PWM_4) R605.P$2
N$73: J601.16(PWM_5) R604.P$2
N$74: J601.13(PWM_6) R603.P$2
N$110 [power]: D602.CATHODE(C) D603.C L601.P$1
PPM-SBUS-PROT: J601.1(PPM/S.BUS_IN) R609.P$2
PPM_INPUT: D601.C R609.P$1 U602.2(A) ; also sheet 5
RX-VDD_5V5: J601.2(5V) ; also sheet 7
SBUS_INPUT: U602.4(Y) ; also sheet 5
VDD_SERVO [power]: D602.ANODE(A) J601.5(5V) J601.8(5V) J601.11(5V) J601.14(5V) J601.17(5V) J601.20(5V) J601.23(5V) J601.26(5V) J601.29(5V) R610.P$2 ; also sheet 8,9
VDD_SERVO_IN [power]: L601.P$2 ; also sheet 7
VDD_SERVO_SENS: R611.P$1 R612.P$2 ; also sheet 5
Unconnected: J601.4(BEC_IN)

### Notes on the sheet
- Servo outputs
- S.Bus input
- Servo Header
  S.Bus interface

## Sheet 7 of 9
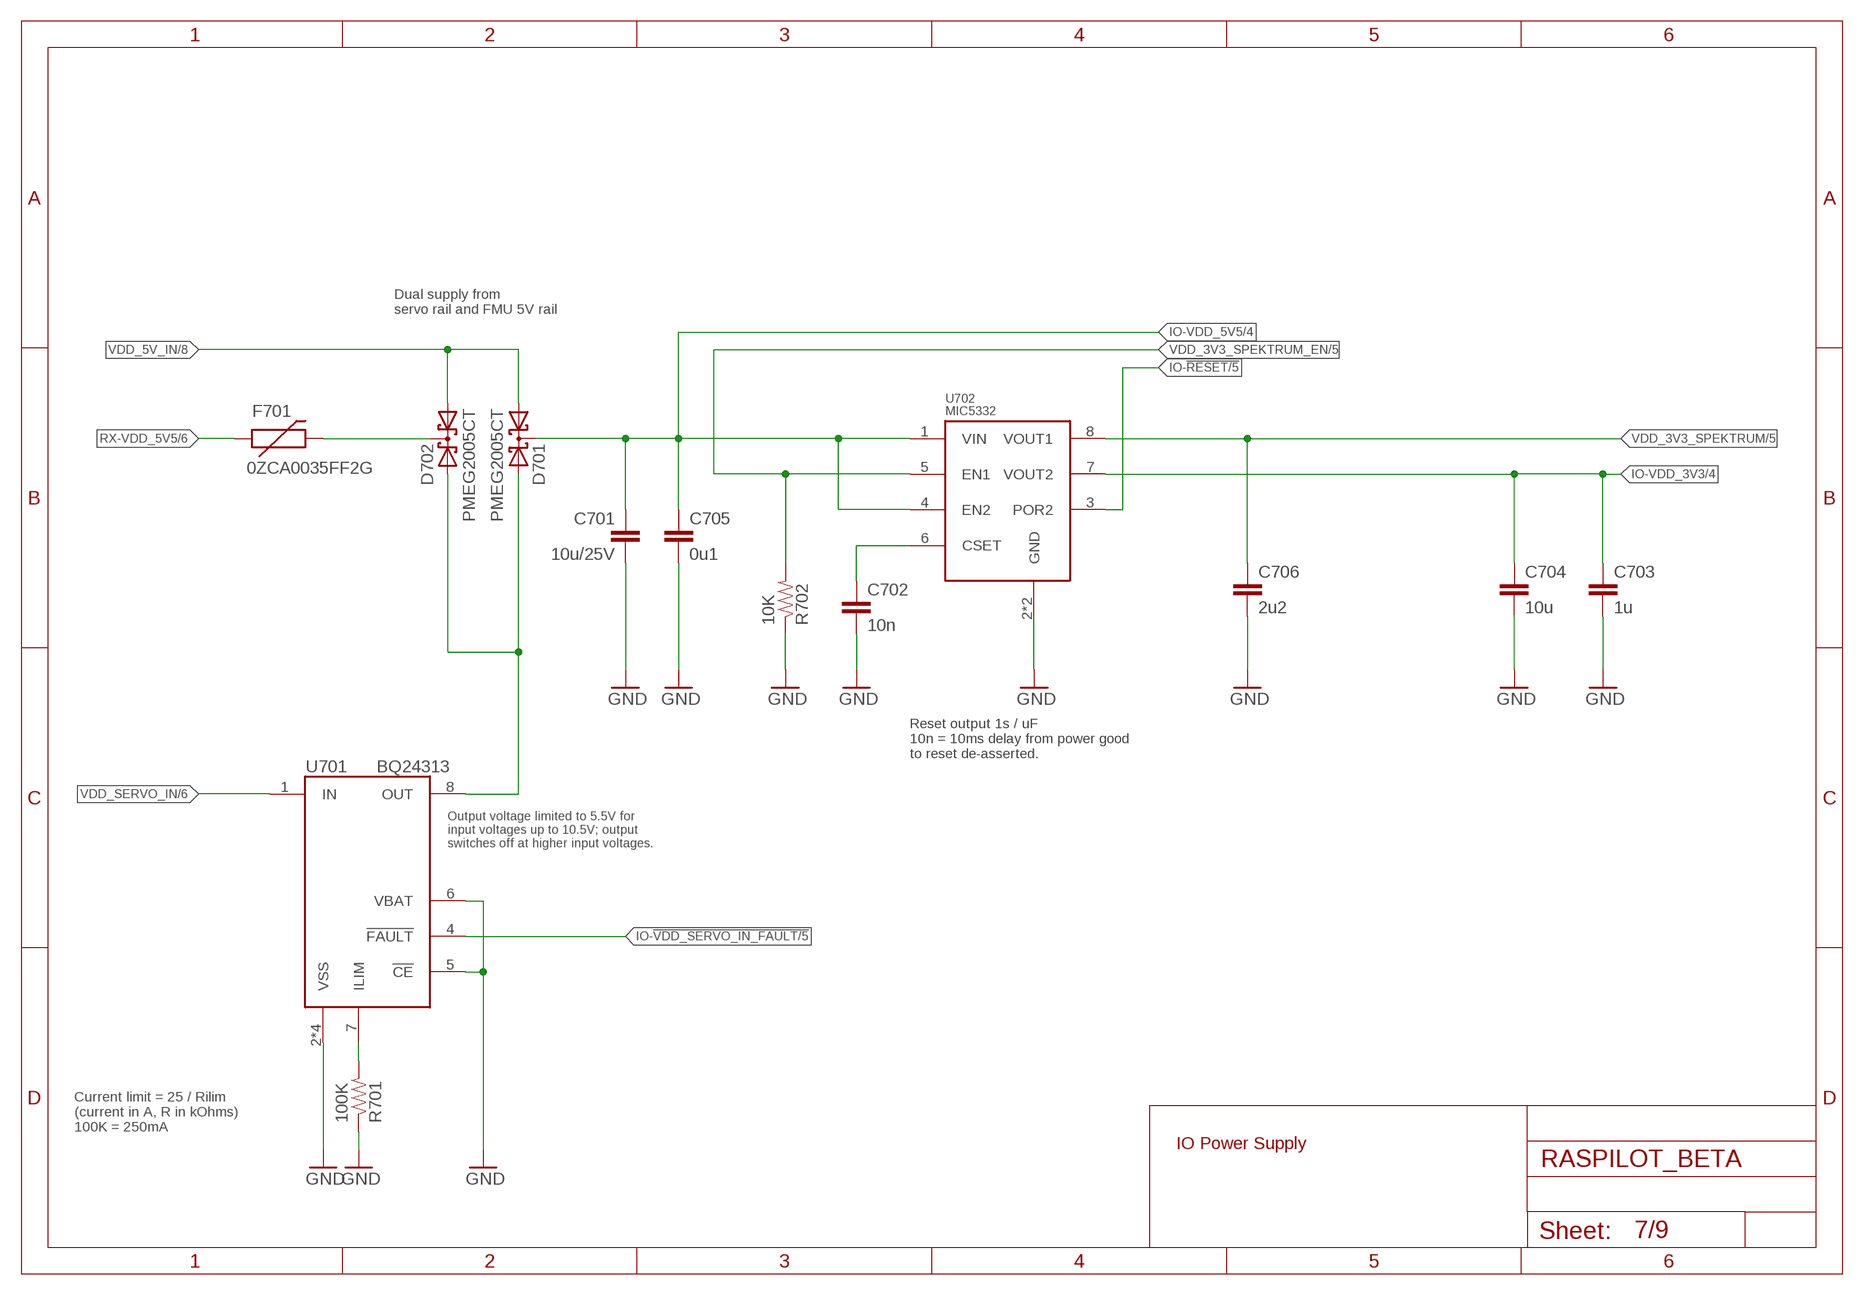
[diagram p6: schematic, sheet 7]

### Parts
C701  10u/25V  CAP0805  [0805-CAP]
C702  10n  CAP0402  [0402-CAP]
C703  1u  CAP0603  [0603-CAP]
C704  10u  CAP0603  [0603-CAP]
C705  0u1  CAP0402  [0402-CAP]
C706  2u2  CAP0402  [0402-CAP]
D701  PMEG2005CT  [SOT23-3]
D702  PMEG2005CT  [SOT23-3]
F701  0ZCA0035FF2G  PTCSMD  [PTC-1206]
R701  100K  RESISTOR0402-RES  [0402-RES]
R702  10K  RESISTOR0402-RES  [0402-RES]
U701  BQ24313  [QFN8-DSG]
U702  MIC5332  [MLF-8-EPAD]

### Nets
GND [power]: C701.P$2 C702.P$2 C703.P$2 C704.P$2 C705.P$2 C706.P$2 R701.P$1 R702.P$1 U701.2(VSS) U701.5(!CE) U701.6(VBAT) U701.GND(VSS) U701.P$2(VSS) U701.P$3(VSS) U702.2(GND) U702.GND ; also sheet 1,2,3,4,5,6,8,9
IO-!RESET: U702.3(POR2) ; also sheet 5
IO-!VDD_SERVO_IN_FAULT: U701.4(!FAULT) ; also sheet 5
IO-VDD_3V3 [power]: C703.P$1 C704.P$1 U702.7(VOUT2) ; also sheet 4,5,6
IO-VDD_5V5 [power]: C701.P$1 C705.P$1 D701.3(CC) U702.1(VIN) U702.4(EN2) ; also sheet 4
N$4 [power]: D701.2(A2) D702.2(A2) U701.8(OUT)
N$20: R701.P$2 U701.7(ILIM)
N$46: D702.3(CC) F701.2
N$104: C702.P$1 U702.6(CSET)
RX-VDD_5V5: F701.1 ; also sheet 6
VDD_3V3_SPEKTRUM [power]: C706.P$1 U702.8(VOUT1) ; also sheet 5
VDD_3V3_SPEKTRUM_EN: R702.P$2 U702.5(EN1) ; also sheet 5
VDD_5V_IN [power]: D701.1(A1) D702.1(A1) ; also sheet 1,2,4,8,9
VDD_SERVO_IN [power]: U701.1(IN) ; also sheet 6

### Notes on the sheet
- Dual supply from
  servo rail and FMU 5V rail
- Reset output 1s / uF
  10n = 10ms delay from power good
  to reset de-asserted.
- Output voltage limited to 5.5V for
  input voltages up to 10.5V; output
  switches off at higher input voltages.
- Current limit = 25 / Rilim
  (current in A, R in kOhms)
  100K = 250mA
- IO Power Supply

## Sheet 8 of 9
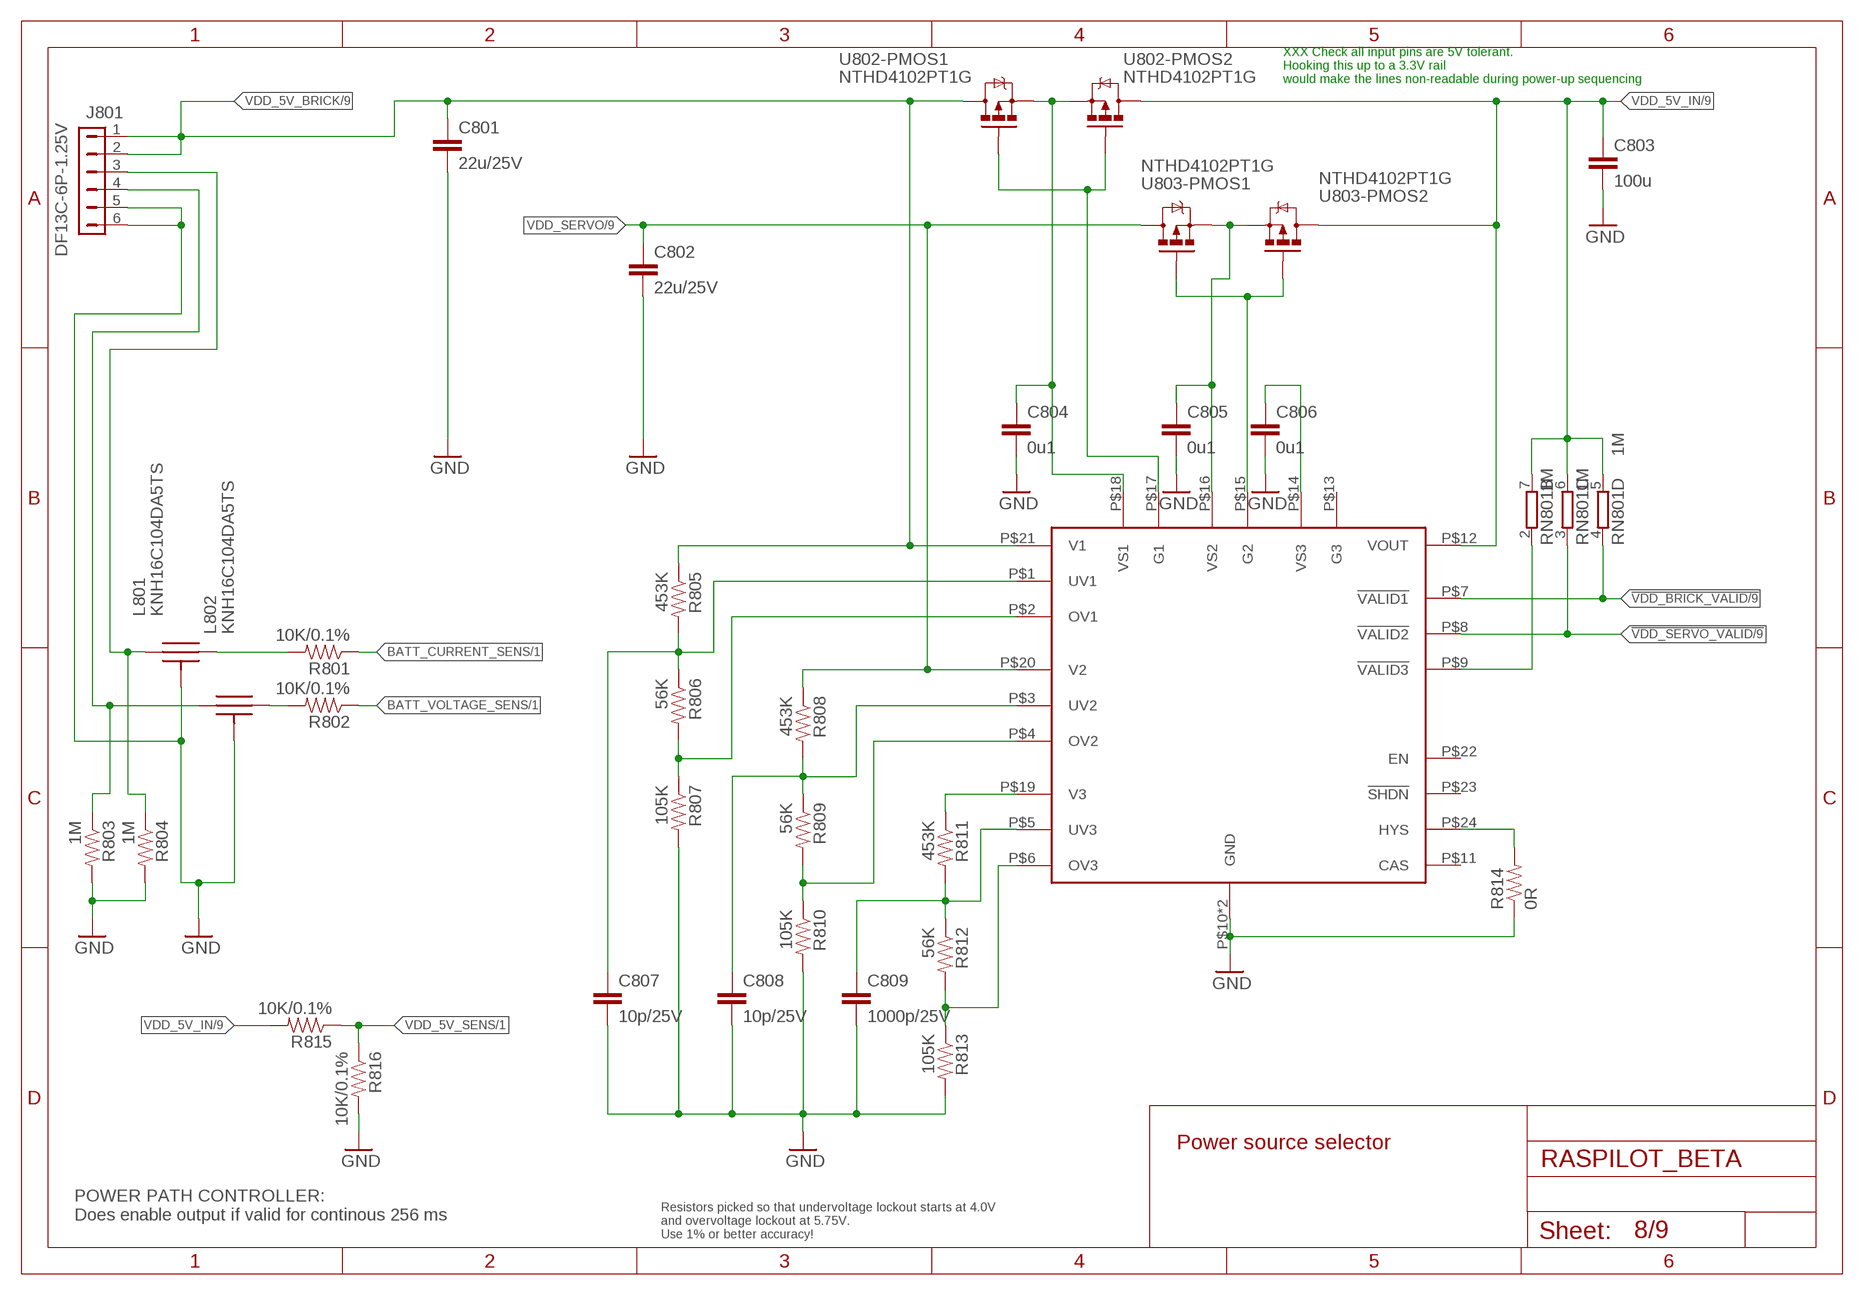
[diagram p7: schematic, sheet 8]

### Parts
C801  22u/25V  CAP0805  [0805-CAP]
C802  22u/25V  CAP0805  [0805-CAP]
C803  100u  CAP1206  [1206-CAP]
C804  0u1  CAP0402  [0402-CAP]
C805  0u1  CAP0402  [0402-CAP]
C806  0u1  CAP0402  [0402-CAP]
C807  10p/25V  CAP0402  [0402-CAP]
C808  10p/25V  CAP0402  [0402-CAP]
C809  1000p/25V  CAP0402  [0402-CAP]
J801  DF13C-6P-1.25V  DF13-6P-1.25V  [DF13C-6P-1.25V]
L801  KNH16C104DA5TS  [KYOCERA-KNH16-DA]
L802  KNH16C104DA5TS  [KYOCERA-KNH16-DA]
R801  10K/0.1%  RESISTOR0402-RES  [0402-RES]
R802  10K/0.1%  RESISTOR0402-RES  [0402-RES]
R803  1M  RESISTOR0402-RES  [0402-RES]
R804  1M  RESISTOR0402-RES  [0402-RES]
R805  453K  RESISTOR0402-RES  [0402-RES]
R806  56K  RESISTOR0402-RES  [0402-RES]
R807  105K  RESISTOR0402-RES  [0402-RES]
R808  453K  RESISTOR0402-RES  [0402-RES]
R809  56K  RESISTOR0402-RES  [0402-RES]
R810  105K  RESISTOR0402-RES  [0402-RES]
R811  453K  RESISTOR0402-RES  [0402-RES]
R812  56K  RESISTOR0402-RES  [0402-RES]
R813  105K  RESISTOR0402-RES  [0402-RES]
R814  0R  RESISTOR0402-RES  [0402-RES]
R815  10K/0.1%  RESISTOR0402-RES  [0402-RES]
R816  10K/0.1%  RESISTOR0402-RES  [0402-RES]
RN801  1M  4R-NEXB28V  [EXB28V]
U801  LTC4417  LTC4117  [MO-220]
U802  NTHD4102PT1G  MOSFET-DUAL-PCHANNEL-CHIPFET  [1206-8]
U803  NTHD4102PT1G  MOSFET-DUAL-PCHANNEL-CHIPFET  [1206-8]

### Nets
!VDD_BRICK_VALID: RN801.4 U801.P$7(!VALID1) ; also sheet 1,9
!VDD_SERVO_VALID: RN801.3 U801.P$8(!VALID2) ; also sheet 1,9
BATT_CURRENT_SENS: R801.P$1 ; also sheet 1
BATT_CURRENT_SENS_PROT: J801.3 L801.P$1 R804.P$1
BATT_VOLTAGE_SENS: R802.P$1 ; also sheet 1
BATT_VOLTAGE_SENS_PROT: J801.4 L802.P$1 R803.P$1
GND [power]: C801.P$2 C802.P$2 C803.P$2 C804.P$2 C805.P$2 C806.P$2 C807.P$2 C808.P$2 C809.P$2 J801.5 J801.6 L801.P$3 L801.P$4 L801.P$5 L802.P$3 L802.P$4 L802.P$5 R803.P$2 R804.P$2 R807.P$2 R810.P$2 R813.P$2 R814.P$1 R816.P$2 U801.P$10(GND) U801.P$25(GND) ; also sheet 1,2,3,4,5,6,7,9
N$47: C807.P$1 R805.P$2 R806.P$1 U801.P$1(UV1)
N$54: R806.P$2 R807.P$1 U801.P$2(OV1)
N$55: C808.P$1 R808.P$2 R809.P$1 U801.P$3(UV2)
N$56: R809.P$2 R810.P$1 U801.P$4(OV2)
N$67: R812.P$2 R813.P$1 U801.P$6(OV3)
N$69: C809.P$1 R811.P$2 R812.P$1 U801.P$5(UV3)
N$75: RN801.2 U801.P$9(!VALID3)
N$97 [power]: C804.P$1 U801.P$18(VS1) U802.P$1(-PMOS1:S) U802.P$3(-PMOS2:S)
N$102: L802.P$2 R802.P$2
N$103: L801.P$2 R801.P$2
N$105: R814.P$2 U801.P$24(HYS)
N$106 [power]: C805.P$1 U801.P$16(VS2) U803.P$1(-PMOS1:S) U803.P$3(-PMOS2:S)
N$107 [power]: C806.P$1 U801.P$14(VS3)
N$113: U801.P$15(G2) U803.P$2(-PMOS1:G) U803.P$4(-PMOS2:G)
N$115: U801.P$17(G1) U802.P$2(-PMOS1:G) U802.P$4(-PMOS2:G)
VBUS [power]: R811.P$1 U801.P$19(V3)
VDD_5V_BRICK [power]: C801.P$1 J801.1 J801.2 R805.P$1 U801.P$21(V1) U802.P$7(-PMOS1:D) U802.P$8(-PMOS1:D) ; also sheet 9
VDD_5V_IN [power]: C803.P$1 R815.P$2 RN801.5 RN801.6 RN801.7 U801.P$12(VOUT) U802.P$5(-PMOS2:D) U802.P$6(-PMOS2:D) U803.P$5(-PMOS2:D) U803.P$6(-PMOS2:D) ; also sheet 1,2,4,7,9
VDD_5V_SENS: R815.P$1 R816.P$1 ; also sheet 1
VDD_SERVO [power]: C802.P$1 R808.P$1 U801.P$20(V2) U803.P$7(-PMOS1:D) U803.P$8(-PMOS1:D) ; also sheet 6,9
Unconnected: RN801.1 RN801.8 U801.P$11(CAS) U801.P$13(G3) U801.P$22(EN) U801.P$23(!SHDN)

### Notes on the sheet
- XXX Check all input pins are 5V tolerant.
  Hooking this up to a 3.3V rail
  would make the lines non-readable during power-up sequencing
- Power source selector
- POWER PATH CONTROLLER:
  Does enable output if valid for continous 256 ms
- Resistors picked so that undervoltage lockout starts at 4.0V
  and overvoltage lockout at 5.75V.
  Use 1% or better accuracy!

## Sheet 9 of 9
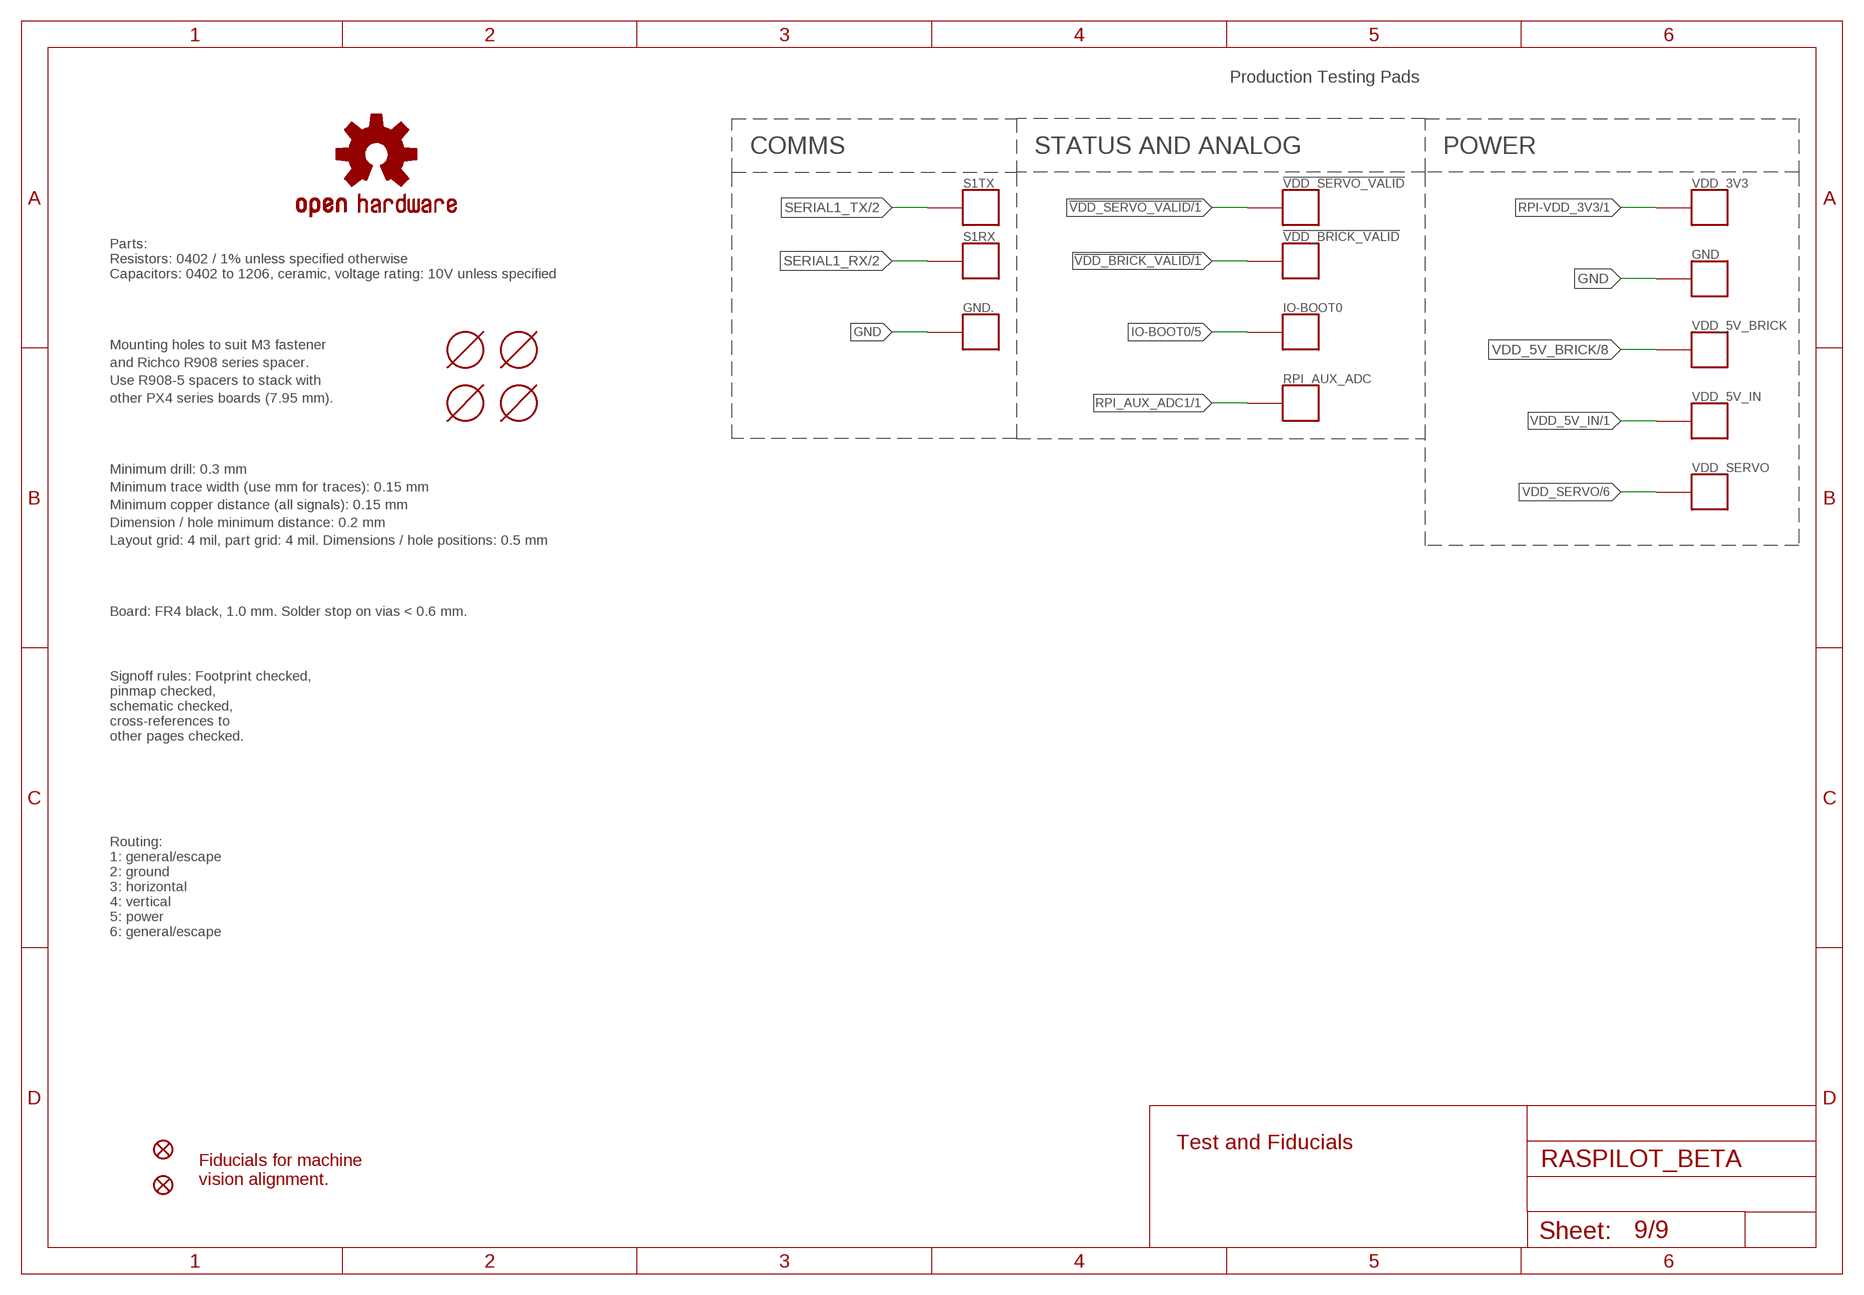
[diagram p8: schematic, sheet 9]

### Parts
!VDD_BRICK_VALID  PAD.04  [PAD.04X.04]
!VDD_SERVO_VALID  PAD.04  [PAD.04X.04]
GND  PAD.04  [PAD.04X.04]
GND.  PAD.04  [PAD.04X.04]
IO-BOOT0  PAD.04  [PAD.04X.04]
JP1  FIDUCIAL1.5X3  [FIDUCIAL-1.5X3]
JP2  FIDUCIAL1.5X3  [FIDUCIAL-1.5X3]
M3_MOUNT1101  MOUNT-HOLE3.1MM  [MOUNT-HOLE3.1]
M3_MOUNT1102  MOUNT-HOLE3.1MM  [MOUNT-HOLE3.1]
M3_MOUNT1103  MOUNT-HOLE3.1MM  [MOUNT-HOLE3.1]
M3_MOUNT1104  MOUNT-HOLE3.1MM  [MOUNT-HOLE3.1]
OSHW_LOGO  OSHW-LOGOS  [OSHW-LOGO-S]
RPI_AUX_ADC  PAD.04  [PAD.04X.04]
S1RX  PAD.04  [PAD.04X.04]
S1TX  PAD.04  [PAD.04X.04]
VDD_3V3  PAD.04  [PAD.04X.04]
VDD_5V_BRICK  PAD.04  [PAD.04X.04]
VDD_5V_IN  PAD.04  [PAD.04X.04]
VDD_SERVO  PAD.04  [PAD.04X.04]

### Nets
!VDD_BRICK_VALID: !VDD_BRICK_VALID.P$1 ; also sheet 1,8
!VDD_SERVO_VALID: !VDD_SERVO_VALID.P$1 ; also sheet 1,8
GND [power]: GND..P$1 GND.P$1 ; also sheet 1,2,3,4,5,6,7,8
IO-BOOT0: IO-BOOT0.P$1 ; also sheet 5
RPI-VDD_3V3 [power]: VDD_3V3.P$1 ; also sheet 1,2,3,4
RPI_AUX_ADC1: RPI_AUX_ADC.P$1 ; also sheet 1
SERIAL1_RX: S1RX.P$1 ; also sheet 2
SERIAL1_TX: S1TX.P$1 ; also sheet 2
VDD_5V_BRICK [power]: VDD_5V_BRICK.P$1 ; also sheet 8
VDD_5V_IN [power]: VDD_5V_IN.P$1 ; also sheet 1,2,4,7,8
VDD_SERVO [power]: VDD_SERVO.P$1 ; also sheet 6,8

### Notes on the sheet
- Production Testing Pads
- COMMS | STATUS AND ANALOG | POWER
- Parts:
  Resistors: 0402 / 1% unless specified otherwise
  Capacitors: 0402 to 1206, ceramic, voltage rating: 10V unless specified
- Mounting holes to suit M3 fastener
- and Richco R908 series spacer.
- Use R908-5 spacers to stack with
- other PX4 series boards (7.95 mm).
- Minimum drill: 0.3 mm
- Minimum trace width (use mm for traces): 0.15 mm
- Minimum copper distance (all signals): 0.15 mm
- Dimension / hole minimum distance: 0.2 mm
- Layout grid: 4 mil, part grid: 4 mil. Dimensions / hole positions: 0.5 mm
- Board: FR4 black, 1.0 mm. Solder stop on vias < 0.6 mm.
- Signoff rules: Footprint checked,
  pinmap checked,
  schematic checked, 
  cross-references to
  other pages checked.
- Routing:
  1: general/escape
  2: ground
  3: horizontal
  4: vertical
  5: power
  6: general/escape
- Test and Fiducials
- Fiducials for machine
  vision alignment.

## Library data of the parts
!VDD_BRICK_VALID !VDD_SERVO_VALID GND GND. IO-BOOT0 RPI_AUX_ADC S1RX S1TX VDD_3V3 VDD_5V_BRICK VDD_5V_IN VDD_SERVO = pixhawk2:PAD: Test pad This footprint includes three classes: The actual test pads, a pogo-pin footprint to mount the pogo-pin as through-hole part and a hole footprint which allows the head of the pogo-pin to pass through (do NOT use the hole to mount the pogo-pin). In a typical test setup, the stack would consist of three PCBs: The actual PCB under testing with a test pad on the bottom, then a second PCB with the hole for the pogo-pin head where the PCB under testing is pressed on and a third PCB at 30 mm / 1.2" distance with the pogo-pin footprints. The pogo-pins are soldered to the last PCB. To create the stack, copy the board under testing and exchange the footprints - this way the correct positioning is ensured.; BOM: EXCLUDE; PARTNO: *
C101 C102 C201 C301 C302 C304 C305 C307-C309 C401 C501-C504 C601 C602 C705 = pixhawk2:CAP: Capacitor Standard 0603 ceramic capacitor, and 0.1" leaded capacitor.; PARTNO: CC0402ZRY5V7BB104
C202 C803 = pixhawk2:CAP: Capacitor Standard 0603 ceramic capacitor, and 0.1" leaded capacitor.; PARTNO: C3216X5R1A107M160AC
C303 C306 = pixhawk2:CAP: Capacitor Standard 0603 ceramic capacitor, and 0.1" leaded capacitor.; PARTNO: C1608X6S1C225K080AC
C505 C506 = pixhawk2:CAP: Capacitor Standard 0603 ceramic capacitor, and 0.1" leaded capacitor.; PARTNO: C1005C0G1H080C
C701 = pixhawk2:CAP: Capacitor Standard 0603 ceramic capacitor, and 0.1" leaded capacitor.; PARTNO: CL21A106KAYNNNE
C702 = pixhawk2:CAP: Capacitor Standard 0603 ceramic capacitor, and 0.1" leaded capacitor.; PARTNO: CC0402KRX7R7BB103
C703 = pixhawk2:CAP: Capacitor Standard 0603 ceramic capacitor, and 0.1" leaded capacitor.; PARTNO: CC0603ZRY5V7BB105
C704 = pixhawk2:CAP: Capacitor Standard 0603 ceramic capacitor, and 0.1" leaded capacitor.; PARTNO: C1608X5R1A106K080AC
C706 = pixhawk2:CAP: Capacitor Standard 0603 ceramic capacitor, and 0.1" leaded capacitor.; PARTNO: C1005X6S1C225K050BC
C801 C802 = pixhawk2:CAP: Capacitor Standard 0603 ceramic capacitor, and 0.1" leaded capacitor.; PARTNO: CL21A226MAQNNNE
C804-C806 = pixhawk2:CAP: Capacitor Standard 0603 ceramic capacitor, and 0.1" leaded capacitor.; PARTNO: C1005X7R1E104K050BB
C807 C808 = pixhawk2:CAP: Capacitor Standard 0603 ceramic capacitor, and 0.1" leaded capacitor.; PARTNO: C0402C100J3GACTU
C809 = pixhawk2:CAP: Capacitor Standard 0603 ceramic capacitor, and 0.1" leaded capacitor.; PARTNO: GRM1555C1E102JA01D
D201 D202 D401 D501 D601 D603 = pixhawk2:DIODE-TVS; PARTNO: PESD0402-140
D301 = pixhawk2:DIODE
D602 = pixhawk2:DIODE-SCHOTTKY: Schottky barrier diode in DO214AC, e.g. Fairchild SS14.; PARTNO: MSS1P4-M3/89A
D701 D702 = pixhawk2:PMEG2005CT: 500 mA low VF dual MEGA Schottky barrier rectifier http://www.nxp.com/documents/data_sheet/PMEG2005CT.pdf; PARTNO: PMEG2005CT
F701 = pixhawk2:PTC: Resettable Fuse PTC Resettable Fuse. Spark Fun Electronics SKU : COM-08357; PARTNO: 0ZCA0035FF2G
J101 = e14_Rpi2_RevA:RPI2: Device for Raspberry Pi 2 board created by www.element14.com More information and support community is available at http://www.element14.com/community/community/raspberry-pi/raspberrypi2
J201 J801 = con-hirose-df13:DF13-6P-1.25: DF13-6P 1.25mm Pitch Miniature Crimping Connector.; PARTNO: DF13C-6P-1.25V(20)
J202 = con-hirose-df13:DF13-4P-1.25: DF13-4P 1.25mm Pitch Miniature Crimping Connector.; PARTNO: DF13C-4P-1.25V(20)
J301 = pixhawk2:RF-MCX
J401 = con-hirose-df13:DF13-3P-1.25: DF13-3P 1.25mm Pitch Miniature Crimping Connector.; PARTNO: DF13C-3P-1.25V(20)
J501 = for-transfers:JST-ZH-3; PARTNO: B3B-ZR-SM4-TF (LF)(SN)(P)
J601 = pixhawk2:HEADER-3X10
JP1 JP2 = pixhawk2:FIDUCIAL: Fiducial Alignment Points Various fiducial points for machine vision alignment.; BOM: EXCLUDE; PARTNO: *
JX501 = pixhawk2:HEADER-3X1: Single row 0.1" servo header; BOM: EXCLUDE
JX502 = pixhawk2:ARM_MINI_JTAG: CONNECTOR wire to board 1.25 mm (.049 inch) pitch header; BOM: EXCLUDE; PARTNO: M50-3900542
L201 L202 L601 L801 L802 = pixhawk2:KNH16C104DA5TS: Kyocera KNH16C104DA5TS EMI filter; PARTNO: KNH16C104DA5TS
L301 = pixhawk2:INDUCTOR: Inductors Basic Inductor/Choke - 0603 and 1210. Footprints are not proven and vary greatly between part numbers. SRR1210: Bourns SRR1210 parts, e.g. SRR1210-100M
LED402 = pixhawk2:LED: LEDs Standard schematic elements and footprints for 5mm, 3mm, 1206, and 0603 sized LEDs. 5mm - Spark Fun Electronics SKU : COM-00529 (and others); PARTNO: APTD1608CGCK
LED403 = pixhawk2:LED: LEDs Standard schematic elements and footprints for 5mm, 3mm, 1206, and 0603 sized LEDs. 5mm - Spark Fun Electronics SKU : COM-00529 (and others); PARTNO: APTD1608SECK
LED405 = pixhawk2:LED: LEDs Standard schematic elements and footprints for 5mm, 3mm, 1206, and 0603 sized LEDs. 5mm - Spark Fun Electronics SKU : COM-00529 (and others); PARTNO: APTD1608QBC/D
M3_MOUNT1101-M3_MOUNT1104 = pixhawk2:MOUNT-HOLE; BOM: EXCLUDE; PARTNO: *
OSHW_LOGO = pixhawk2:OSHW-LOGO: Open Source Hardware Logo This logo indicates the piece of hardware it is found on incorporates a OSHW license and/or adheres to the definition of open source hardware found here: http://freedomdefined.org/OSHW; BOM: EXCLUDE; PARTNO: *
Q401 = pixhawk2:MOSFET-NCHANNEL
R201 R202 R414 = pixhawk2:RESISTOR: Resistor Basic schematic elements and footprints for 0603, 1206, and PTH 1/10th watt (small) resistors.; PARTNO: RC0402FR-071K5L
R203 R204 = pixhawk2:RESISTOR: Resistor Basic schematic elements and footprints for 0603, 1206, and PTH 1/10th watt (small) resistors.; PARTNO: RC0402FR-07120RL
R205 = pixhawk2:RESISTOR: Resistor Basic schematic elements and footprints for 0603, 1206, and PTH 1/10th watt (small) resistors.; PARTNO: RMCF0402FT25K5
R206 R401 R402 R503 R506 R702 = pixhawk2:RESISTOR: Resistor Basic schematic elements and footprints for 0603, 1206, and PTH 1/10th watt (small) resistors.; PARTNO: RC0402FR-0710KL
R207 R803 R804 = pixhawk2:RESISTOR: Resistor Basic schematic elements and footprints for 0603, 1206, and PTH 1/10th watt (small) resistors.; PARTNO: RC0402FR-071ML
R208 R209 R409-R412 R501 R502 R504 R505 R601-R609 = pixhawk2:RESISTOR: Resistor Basic schematic elements and footprints for 0603, 1206, and PTH 1/10th watt (small) resistors.; PARTNO: RC0402FR-07220RL
R301 = pixhawk2:RESISTOR: Resistor Basic schematic elements and footprints for 0603, 1206, and PTH 1/10th watt (small) resistors.
R302 R403 = pixhawk2:RESISTOR: Resistor Basic schematic elements and footprints for 0603, 1206, and PTH 1/10th watt (small) resistors.; PARTNO: RMCF0402FT16K5
R404 R405 = pixhawk2:RESISTOR: Resistor Basic schematic elements and footprints for 0603, 1206, and PTH 1/10th watt (small) resistors.; PARTNO: RMCF0402FT9K09
R413 = pixhawk2:RESISTOR: Resistor Basic schematic elements and footprints for 0603, 1206, and PTH 1/10th watt (small) resistors.; PARTNO: ERJ-2GEJ680X
R610-R612 R801 R802 R815 R816 = pixhawk2:RESISTOR: Resistor Basic schematic elements and footprints for 0603, 1206, and PTH 1/10th watt (small) resistors.; PARTNO: ERA-2AEB103X
R701 = pixhawk2:RESISTOR: Resistor Basic schematic elements and footprints for 0603, 1206, and PTH 1/10th watt (small) resistors.; PARTNO: RC0402FR-07100KL
R805 R808 R811 = pixhawk2:RESISTOR: Resistor Basic schematic elements and footprints for 0603, 1206, and PTH 1/10th watt (small) resistors.; PARTNO: RMCF0402FT453K
R806 R809 R812 = pixhawk2:RESISTOR: Resistor Basic schematic elements and footprints for 0603, 1206, and PTH 1/10th watt (small) resistors.; PARTNO: ERA-2AEB563X
R807 R810 R813 = pixhawk2:RESISTOR: Resistor Basic schematic elements and footprints for 0603, 1206, and PTH 1/10th watt (small) resistors.; PARTNO: ERJ-2RKF1053X
R814 = pixhawk2:RESISTOR: Resistor Basic schematic elements and footprints for 0603, 1206, and PTH 1/10th watt (small) resistors.; PARTNO: ERJ-2GE0R00X
RN801 = resistor-dil:4R-N: Array Chip Resistor Source: RS Component / Phycomp; OC_FARNELL: unknown; OC_NEWARK: unknown; PARTNO: EXB-28V105JX
S501 = pixhawk2:SWITCH-MOMENTARY-2; PARTNO: EVQ-P7J01P
SG401 = pixhawk2:BUZZER: BUZZER Source: Buerklin; OC_FARNELL: unknown; OC_NEWARK: unknown
SJ301 = SparkFun-Retired:SOLDERJUMPER: Solder Jumper Standard SMD solder jumper. Used to automate production. Two varients : Normally Open and Normally Closed are the same, but have different paste layers. NC will have a large amount of paste and should jumper during reflow.
U101 = SparkFun-AnalogIC:ADS1015: 12-Bit Del-Sig ADC Four single-ended inputs or two differential inputs Internal PGA I2C interface 2.0-5.5V; PROD_ID: IC-12239
U102 = SparkFun-DigitalIC:MB85RC
U201 = pixhawk2:TXS0102: TI TXS0102 Level Shifter Auto-sensing level shifter, e.g. for I2C or UART.
U202 = pixhawk2:BQ24315; PARTNO: BQ24315DSGR
U301 = pixhawk2:MPU-6500
U302 = pixhawk2:HMC5883L: Honeywell HMC5883L 12bit Magnetometer
U303 = pixhawk2:MS5611-01BA: MS5611-01BA The MS5611-01BA is a new generation of high resolution altimeter sensors from MEAS Switzerland with SPI and I 2 C bus interface. It is optimized for altimeters and variometers with an altitude resolution of 10 cm. The sensor module includes a high linearity pressure sensor and an ultra low power 24 bit ?? ADC with internal factory calibrated coefficients. It provides a precise digital 24 Bit pressure and temperature value and different operation modes that allow the user to optimize for conversion speed and current consumption. A high resolution temperature output allows the implementation of an altimeter/thermometer function without any additional sensor. The MS5611-01BA can be interfaced to virtually any microcontroller. The communication protocol is simple, without the need of programming internal registers in the device. Small dimensions of only 5.0 mm x 3.0 mm and a height of 1.7 mm allow for integration in mobile devices. This new sensor module generation is based on leading MEMS technology and latest benefits from MEAS Switzerland proven experience and know-how in high volume manufacturing of altimeter modules, which have been widely used for over a decade. The sensing principle employed leads to very low hysteresis and high stability of both pressure and temperature signal. High resolution module, 10 cm Fast conversion down to 1 ms Low power, 1 µA (standby < 0.15 µA) QFN package 5.0 x 3.0 x 1.7 mm3 Supply voltage 1.8 to 3.6 V Integrated digital pressure sensor (24 bit ?? ADC) Operating range: 10 to 1200 mbar, -40 to +85 °C I2C and SPI interface up to 20 MHz No external components (Internal oscillator) Excellent long term stability; DATASHEET: http://www.meas-spec.com/downloads/MS5611-01BA01.pdf; LINK: http://www.meas-spec.com/product/t_product.aspx?id=8503#; MFGPN: MS5611-01BA; PARTNO: MS5611-01BA
U304 = pixhawk2:NEO-M8N
U401 = pixhawk2:TCA62724FMG: Toshiba TCA62724FMG I2C RGB LED driver; PARTNO: TCA62724FMG
U402 = pixhawk2:RGB-LED: RGB LED with separate anode/cathode terminals; PARTNO: LRTB GFTG-T7AW-1+V7A7-29+R5T9-49-L
U501 = pixhawk2:STM32F10XCXT6: ST STM32F101/103 48pin LQFP; PARTNO: STM32F100C8T6B
U601 = pixhawk2:TXS0108; PARTNO: TXS0108ERGYR
U602 = pixhawk2:74LVC1G125
U701 = pixhawk2:BQ24313; PARTNO: BQ24313DSGT
U702 = pixhawk2:MIC5332; PARTNO: MIC5332-SSYMT
U801 = pixhawk2:LTC4117; PARTNO: LTC4417IUF#PBF
U802 U803 = pixhawk2:MOSFET-DUAL-PCHANNEL; PARTNO: NTHD4102PT1G
UB301 = pixhawk2:MS621FE: SEIKO 6.8mm Rechargeable 3V lithium battery If discontinued or not available, similar devices are available from Panasonic and Sanyo, usually direct replacements.; DATASHEET: http://speed.sii.co.jp/data/file_PRODUCT_MASTER_50112_TITLE_IMAGESP.pdf; LINK: http://search.digikey.com/us/en/products/MS621FE-FL11E/728-1057-ND/1889208; MFGPN: MS621FE
X501 = pixhawk2:OSCILLATOR: Crystal Oscillator in 3.2x2.5 SMD; PARTNO: NX3225SA-24.000000MHZ

## Net classes
0 signal: width 0.15 mm, drill 0.15 mm, clearance 0.152 mm
1 power: width 0.15 mm, drill 0.2 mm, clearance 0.152 mm